# EasyEDA Pro project RCKid.epro, board RCKid
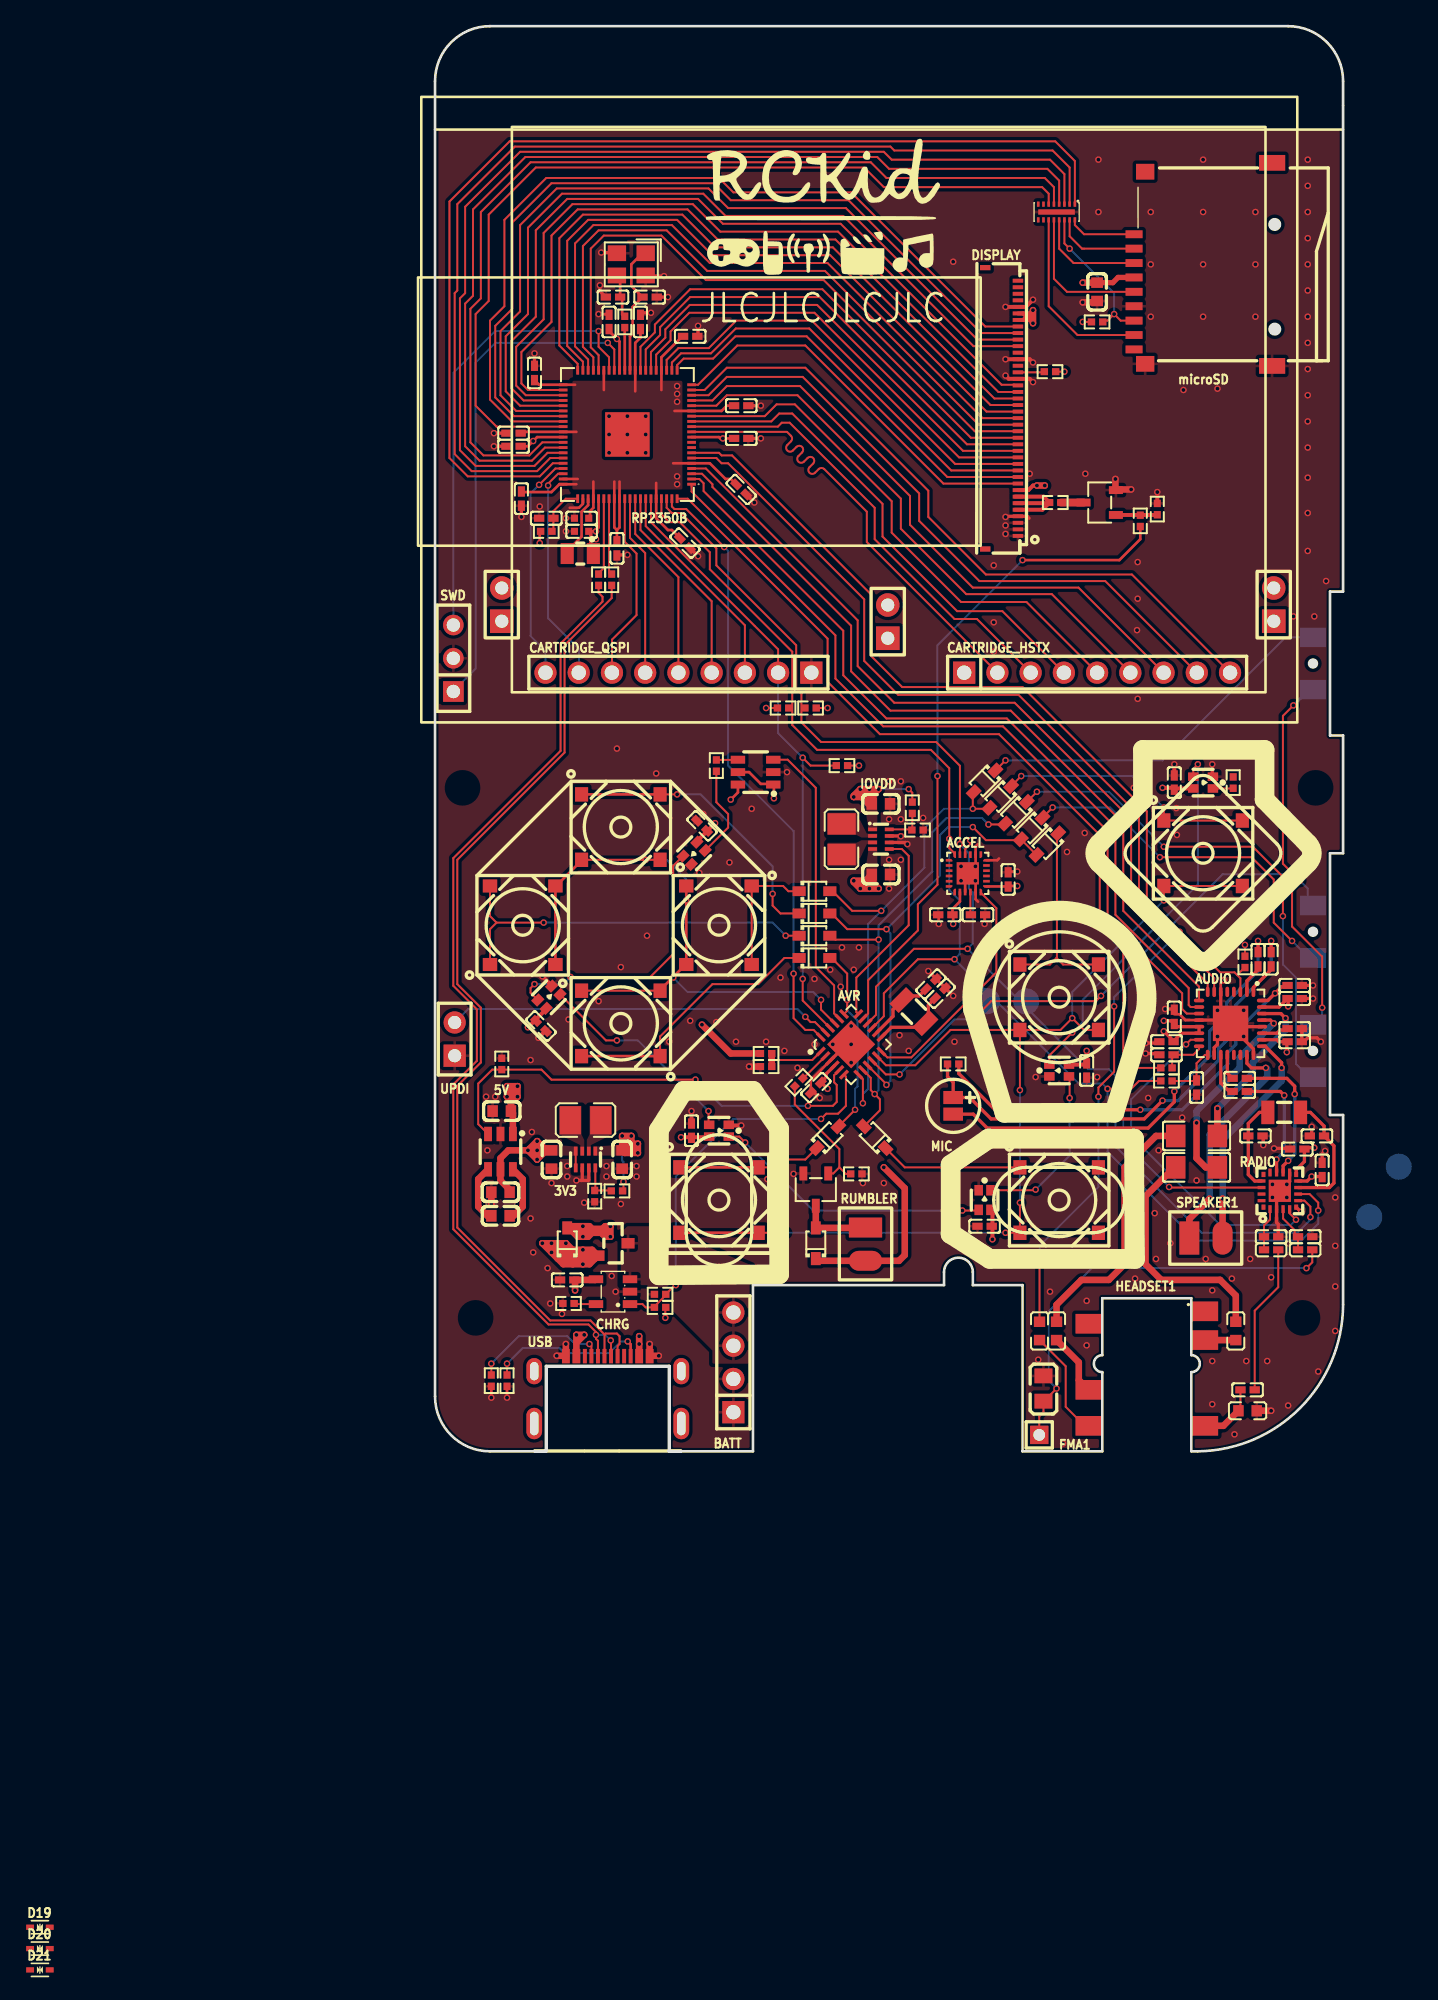
[diagram p27: board, top side]
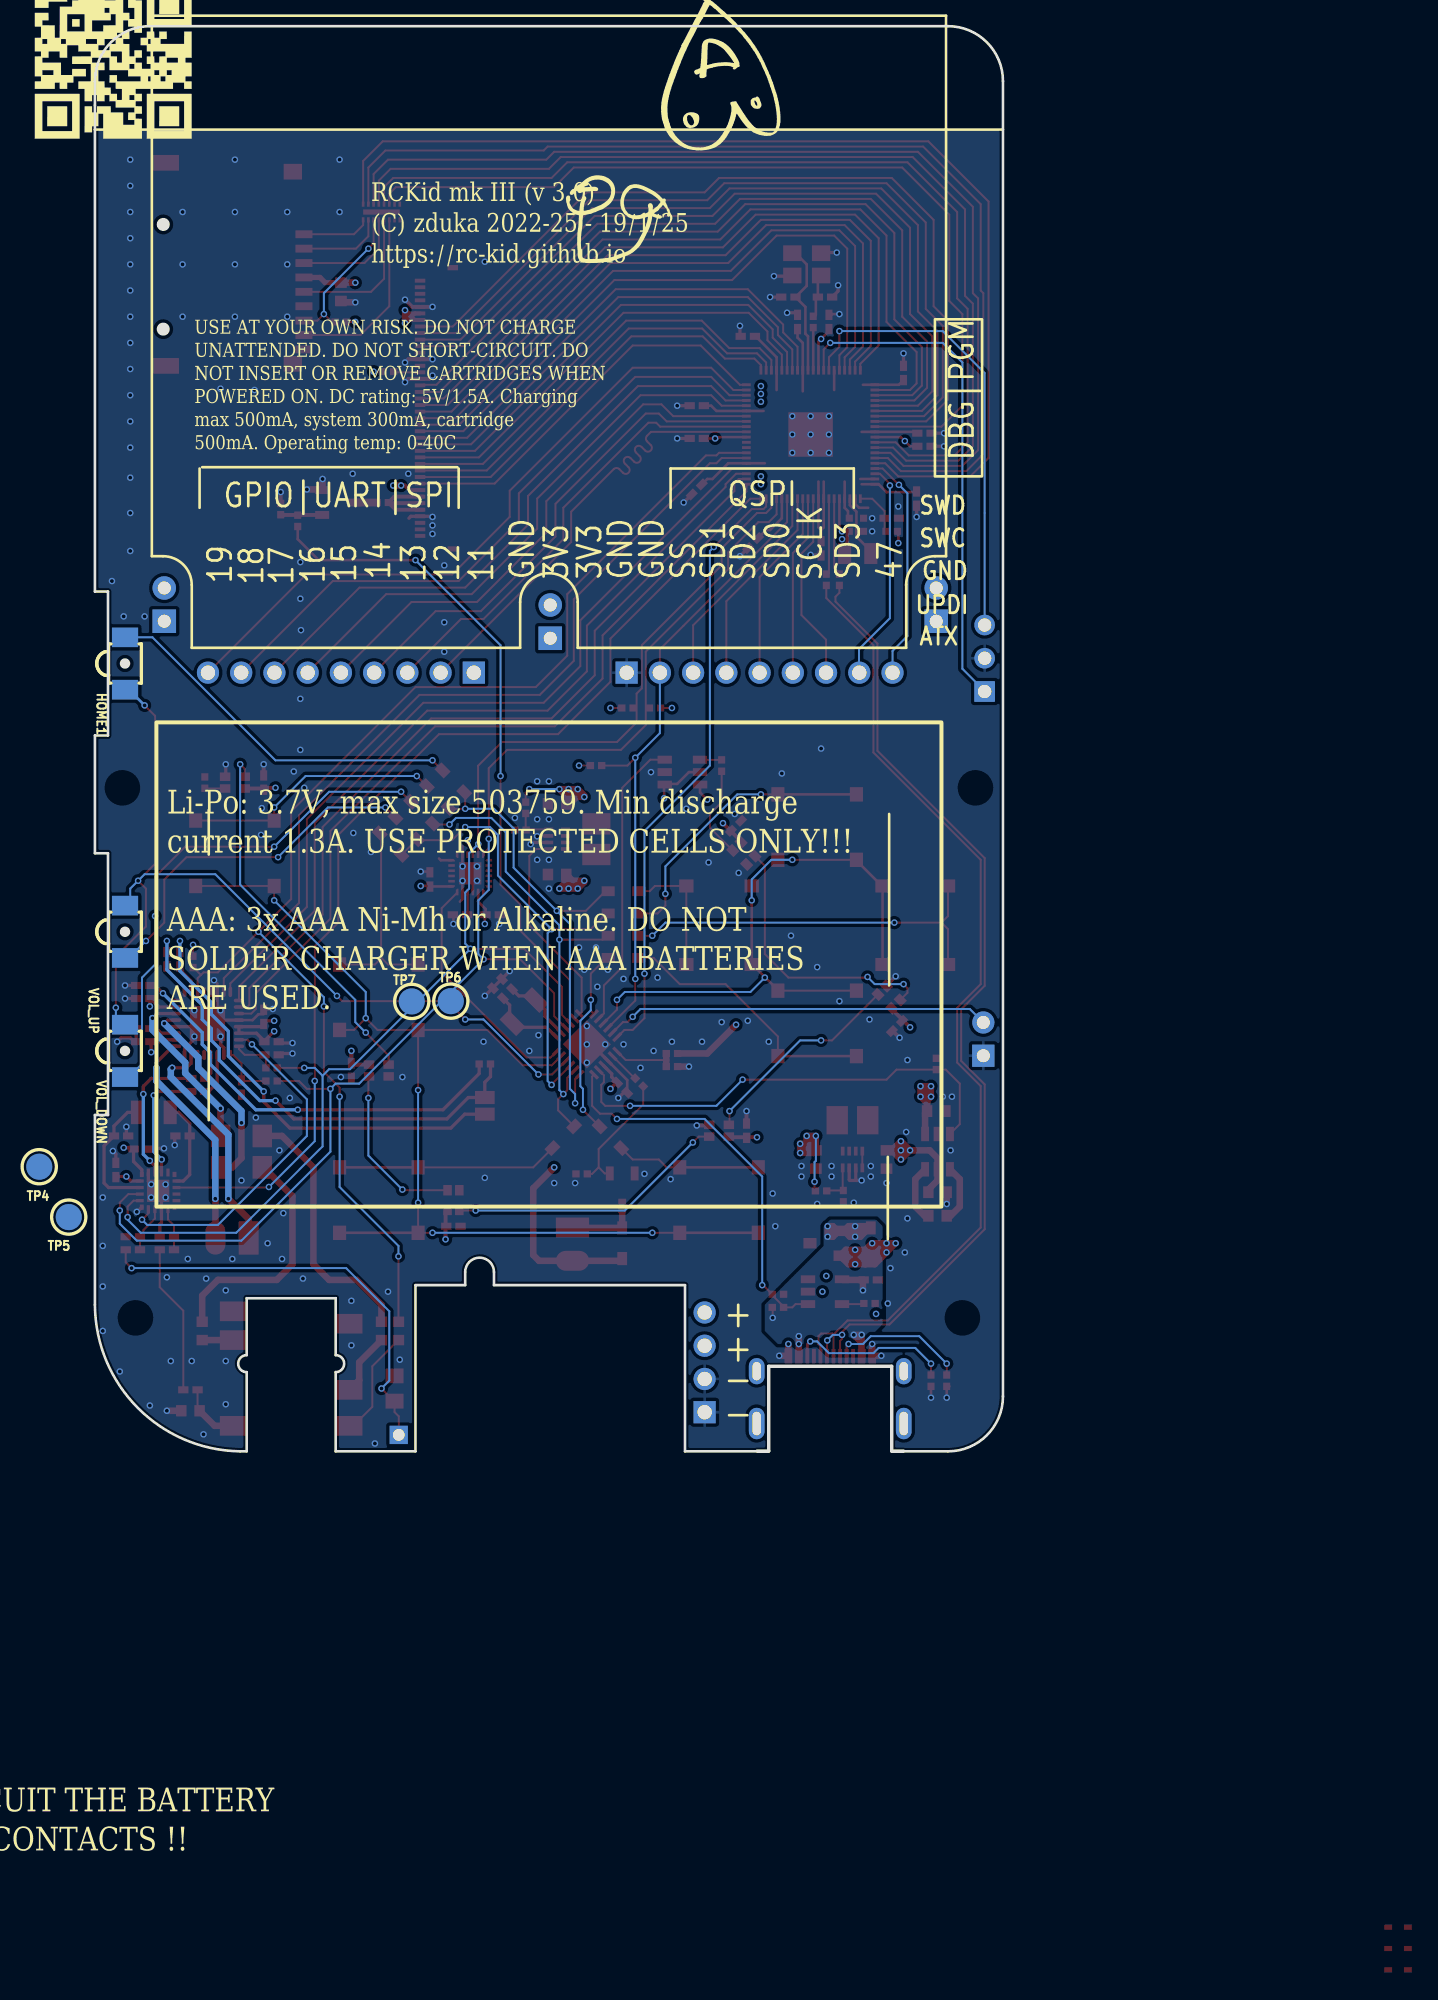
[diagram p28: board, bottom side, seen from below]

Outline 69.4 x 108.9 mm; copper layers: Top Layer, Inner1, Inner2, Bottom Layer. Coordinates in mm from the lower left corner of the outline.
Outline path: 0,104.7 arc(1.23,107.67) 4.2,108.9 65.2,108.9 arc(68.17,107.67) 69.4,104.7 69.4,65.7 68.4,65.7 68.4,54.7 69.4,54.7 69.4,45.7 68.4,45.7 68.4,25.7 69.4,25.7 69.4,11.2 arc(66.14,3.34) 58.3,0 57.8,0 57.8,6.05 arc(58.45,6.7) 57.8,7.35 57.8,11.7 51,11.7 51,7.35 arc(50.35,6.7) 51,6.05 51,0 44.9,0 44.9,12.7 41.1,12.7 41.1,13.7 arc(40,14.8) 38.9,13.7 38.9,12.7 24.3,12.7 24.3,0 17.9,0 17.9,6.5 8.5,6.5 8.5,0 4.2,0 arc(1.23,1.23) 0,4.2 0,104.7
Stack: Top Layer 0.035mm / Dielectric1 0.28mm PP er 4.5 / Inner1 0.035mm / Dielectric2 0.28mm FR4 er 4.5 / Inner2 0.035mm / Dielectric3 0.28mm PP er 4.5 / Bottom Layer 0.035mm

## Design rules (mm)
net USB_DM: DP1
net USB_DP: DP1
template: JLCPCB Capability(Two Layers Board)
spacing copperThickness1oz (default): track to track 0.102, other pairs 0.152 to 0.3
spacing copperThickness2oz: track to track 0.203, other pairs 0.152 to 0.3
track width copperThickness1oz (default): min 0.127, default 0.254, max 2.54
track width copperThickness2oz: min 0.203, default 0.254, max 2.54
differential pair differentialPair (default): width min 0.127, default 0.254, max 2.54; gap min 0.152, default 0.152
via viaSize (default): diameter min 0.5, default 0.61, max 10; hole min 0.3, default 0.305, max 6.3

## Placement (name value [footprint] x y rotation side)
3V3  TPS631000DRLR  [SOT-583-8_L2.1-W1.2-P0.50-LS1.6-BL]  11.5 22.3 180 top
5V  HX4002-MFC  [SOT-23-6_L2.9-W1.6-P0.95-LS2.8-BR]  5 22.9 90 top
A1  SKRRACE010  [KEY-SMD_4P-L7.5-W7.0-P5.00-TL]  47.7 34.7 0 top
ACCEL  MPU-6500  [QFN-24_L3.0-W3.0-P0.40-BL-EP]  40.71 44.17 270 top
AUDIO  NAU88C22YG  [QFN-32_L5.0-W5.0-P0.50-BL-EP2.7]  60.8 32.7 180 top
AVR  ATTINY3217-MFR  [WQFN-24_L4.0-W4.0-P0.50-TL-EP2.6]  31.8 31.1 45 top
B1  SKRRACE010  [KEY-SMD_4P-L7.5-W7.0-P5.00-TL]  58.7 45.7 0 top
B2  SKRRACE010  [KEY-SMD_4P-L7.5-W7.0-P5.00-TL]  47.7 19.2 0 top
B3  SKRRACE010  [KEY-SMD_4P-L7.5-W7.0-P5.00-TL]  21.7 19.2 0 top
BATT  -  [HDR-TH_4P-P2.54-V-M]  22.8 6.8 90 top
BOTTOM1  SKRRACE010  [KEY-SMD_4P-L7.5-W7.0-P5.00-TL]  21.7 40.2 270 top
C81  10uF  [C0603]  5 19.8 0 top
C82  10uF  [C0603]  5.1 26 0 top
C83  2.2uF  [C0603]  5 18 0 top
C101  100nF  [C0402]  49.8 29.1 90 top
C102  100nF  [C0402]  56.5 51.1 270 top
C104  100nF  [C0402]  8.1 32.5 135 top
C107  100nF  [C0402]  23.4 73.5 135 top
C108  100nF  [C0402]  19.1 69.4 135 top
C109  100nF  [C0402]  19.5 85.2 180 top
C110  100nF  [C0402]  6 77.8 0 top
C111  100nF  [C0402]  7.6 82.4 270 top
C112  100nF  [C0402]  23.4 79.9 180 top
C114  100nF  [C0402]  6 76.8 0 top
C115  1uF  [C0402]  23.4 77.4 180 top
C116  1uF  [C0402]  6.6 72.8 90 top
C117  100nF  [C0402]  15.7 86.3 270 top
C118  100nF  [C0402]  29.1 27.8 45 top
C121  1uF  [C0402]  10.1 13.1 0 top
C132  22uF  [C0603]  50.6 88.6 90 top
C143  100nF  [C0402]  19.6 24.5 270 top
C144  100nF  [C0402]  42 17.2 0 top
C153  15pF  [C0402]  16.4 88.2 0 top
C154  15pF  [C0402]  13.6 88.2 180 top
C167  100nF  [C0402]  13.9 69 90 top
C199  220uF  [C1206]  58.2 24.1 0 top
C200  220uF  [C1206]  58.2 21.7 0 top
C209  1uF  [C0402]  61.5 28.5 180 top
C210  4.7uF  [C0402]  13.3 86.3 270 top
C211  4.7uF  [C0402#2]  11.2 71.3 0 top
C212  4.7uF  [C0402#2]  11.2 70.3 0 top
C213  4.7uF  [C0402]  8.5 71.3 180 top
C232  120pF  [C0402]  38.6 35 225 top
C233  120pF  [C0402]  37.9 35.7 225 top
C236  22nF  [C0402]  65.9 23.1 0 top
C237  100nF  [C0402]  67.8 21.5 90 top
C238  120pF  [C0402]  67.4 24.1 180 top
C239  120pF  [C0402]  62.7 24.1 180 top
C242  100pF  [C0402]  62.1 4.7 0 top
C243  33pF  [C0402]  55.9 30.3 180 top
C244  33pF  [C0402]  58.2 27.8 270 top
C245  4.7uF  [C0402]  65.7 34.6 180 top
C246  4.7uF  [C0402]  65.7 31.3 180 top
C247  4.7uF  [C0402]  65.7 32.3 180 top
C248  4.7uF  [C0402]  55.9 31.3 0 top
C249  4.7uF  [C0402]  56.5 33.2 270 top
C250  4.7uF  [C0402]  65.7 35.6 180 top
C251  1uF  [C0402]  61.5 27.5 180 top
C254  1uF  [C0402]  63.9 37.6 90 top
C255  1uF  [C0402]  62.9 37.6 90 top
C256  6pF  [C0402]  63.9 16.4 0 top
C259  22uF  [C0603]  8.9 22.3 90 top
C260  22uF  [C0603]  34.08 44.08 180 top
C261  47uF  [C0603]  14.3 22.3 90 top
C262  47uF  [C0603]  34.08 49.48 180 top
C263  100nF  [C0402]  43.8 43.7 270 top
C264  100nF  [C0402]  41.5 41 180 top
C265  10nF  [C0402]  39 41 0 top
C266  100nF  [C0402]  20.4 47.8 315 top
C267  3.3pF  [C0402]  66.5 16.4 0 top
CARTRIDGE_HSTX  -  [HDR-TH_9P-P2.54-V-M]  50.6 59.5 0 top
CARTRIDGE_QSPI  -  [HDR-TH_9P-P2.54-V-M]  18.6 59.5 180 top
CHRG  MCP73832T-2ACI/OT  [SOT-23-5_L3.0-W1.7-P0.95-LS2.8-BR]  13.6 12.2 0 top
D4  1N5819WS  [SOD-323_L1.8-W1.3-LS2.5-RD]  29.1 15.9 90 top
D5  1N5819WS  [SOD-323_L1.8-W1.3-LS2.5-RD]  29 42.8 0 top
D6  1N5819WS  [SOD-323_L1.8-W1.3-LS2.5-RD]  29 41.1 0 top
D7  1N5819WS  [SOD-323_L1.8-W1.3-LS2.5-RD]  29 39.4 0 top
D8  1N5819WS  [SOD-323_L1.8-W1.3-LS2.5-RD]  29 37.7 0 top
D9  1N5819WS  [SOD-323_L1.8-W1.3-LS2.5-RD]  43.2 50 225 top
D10  1N5819WS  [SOD-323_L1.8-W1.3-LS2.5-RD]  46.8 46.4 225 top
D11  1N5819WS  [SOD-323_L1.8-W1.3-LS2.5-RD]  33.6 24 135 top
D12  1N5819WS  [SOD-323_L1.8-W1.3-LS2.5-RD]  30 24 45 top
D14  1N5819WS  [SOD-323_L1.8-W1.3-LS2.5-RD]  45.6 47.6 225 top
D15  1N5819WS  [SOD-323_L1.8-W1.3-LS2.5-RD]  44.4 48.8 225 top
D17  1N5819WS  [SOD-323_L1.8-W1.3-LS2.5-RD]  42 51.2 225 top
D18  BAT60JFILM  [SOD-323_L1.8-W1.3-LS2.5-RD]  10.1 15.9 90 top
D19  H5VUD5BB  [SOD-523_L1.2-W0.8-LS1.6-BI]  -30.2 -36.37 0 top
D20  H5VUD5BB  [SOD-523_L1.2-W0.8-LS1.6-BI]  -30.2 -38 0 top
D21  H5VUD5BB  [SOD-523_L1.2-W0.8-LS1.6-BI]  -30.2 -39.62 0 top
DISPLAY  X05A10H40G  [FPC-SMD_X05A10H40G]  43.3 79.7 270 top
FMA1  -  [HDR-TH_1P-V-M_XKB_X4611WV-01I-C28D40]  46.18 1.25 0 top
H4  -  [HDR-TH_2P-P2.54-V-M-1]  5.1 64.7 90 top
H5  -  [HDR-TH_2P-P2.54-V-M-1]  64.1 64.7 90 top
H6  -  [HDR-TH_2P-P2.54-V-M-1]  34.6 63.4 90 top
HEADSET1  PJ-342D  [AUDIO-SMD_PJ-342D]  54.4 -0.8 90 top
HOME1  B3U-3000PM-B  [key-smd_b3u-3000pm-b]  67.1 60.2 90 bottom
IOVDD  TPS631000DRLR  [SOT-583-8_L2.1-W1.2-P0.50-LS1.6-BL]  34.08 46.78 270 top
L15  IP4252CZ16-8-TTL,1  [UDFN-16_L3.3-W1.4-P0.40-BL-EP]  47.5 94.7 180 top
L16  AOTA-B201610S3R3-101-T  [IND-SMD_L2.0-W1.6_AOTA-B201610S3R3-101-T]  11.1 68.6 0 top
L18  270nH  [L0603]  62.1 3.1 0 top
L19  120nH  [L0805]  46.5 4.8 90 top
L21  BLM18BD252SN1D  [L0603]  46.2 9.2 90 top
L22  BLM18BD252SN1D  [L0603]  47.5 9.2 90 top
L23  BLM18BD252SN1D  [L0603]  61.2 9.2 90 top
L24  BLM15GA750SN1D  [L0402]  63.9 15.4 0 top
L25  15nH  [L0402]  66.5 15.4 180 top
LED7  XL-1615RGBC-WS2812B  [LED-SMD_4P-L1.6-W1.5_XL-1615RGBC-WS2812B]  47.7 29.1 0 top
LED8  XL-1615RGBC-WS2812B  [LED-SMD_4P-L1.6-W1.5_XL-1615RGBC-WS2812B]  58.7 51.1 180 top
LED10  XL-1615RGBC-WS2812B  [LED-SMD_4P-L1.6-W1.5_XL-1615RGBC-WS2812B]  8.7 34.7 225 top
LED11  XL-1615RGBC-WS2812B  [LED-SMD_4P-L1.6-W1.5_XL-1615RGBC-WS2812B]  21.7 24.5 180 top
LED12  XL-1615RGBC-WS2812B  [LED-SMD_4P-L1.6-W1.5_XL-1615RGBC-WS2812B]  42 19.2 270 top
LED13  XL-1615RGBC-WS2812B  [LED-SMD_4P-L1.6-W1.5_XL-1615RGBC-WS2812B]  19.8 45.7 45 top
LEFT1  SKRRACE010  [KEY-SMD_4P-L7.5-W7.0-P5.00-TL]  14.2 47.7 0 top
MIC  GMI4015-2C-56db  [MIC-SMD_BD4.0_GMI4015-2C-32DB]  39.6 26.4 270 top
microSD  TF-01A  [TF-SMD_TF-01A]  58.7 90.7 90 top
Q6  AO3400A  [SOT-23-3_L2.9-W1.6-P1.90-LS2.8-BR]  50.8 72.5 0 top
Q9  AO3400A  [SOT-23-3_L2.9-W1.6-P1.90-LS2.8-BR]  29.1 20 90 top
Q10  AO3401A  [SOT-23_L2.9-W1.3-P1.90-LS2.4-BR]  13.6 15.9 180 top
R45  2.2kΩ  [R0402]  28.7 56.8 0 top
R46  2.2kΩ  [R0402]  26.6 56.8 180 top
R48  10kΩ  [R0402]  5.1 29.6 90 top
R50  22Ω  [R0402]  12.5 66.6 90 top
R51  22Ω  [R0402]  13.5 66.6 90 top
R54  10kΩ  [R0402]  32.2 21.2 0 top
R55  10kΩ  [R0402]  55.2 72 90 top
R56  10kΩ  [R0402]  31.1 52.4 0 top
R57  5.1kΩ  [R0402]  5.5 5.4 270 top
R58  5.1kΩ  [R0402]  4.3 5.4 270 top
R76  10kΩ  [R0402]  50.6 86.3 0 top
R84  5.11Ω  [R0402]  47.4 72.5 0 top
R86  2.2kΩ  [R0402]  10.2 11.3 0 top
R87  470Ω  [R0402]  21.5 52.4 270 top
R88  470Ω  [R0402]  61 51.1 90 top
R91  1kΩ  [R0402]  27.8 28.2 45 top
R92  1kΩ  [R0402]  53.9 71.1 270 top
R93  1kΩ  [R0402]  14.5 86.3 90 top
R109  33Ω  [R0402]  8.5 70.3 0 top
R128  10kΩ  [R0402]  47 82.5 0 top
R130  220Ω  [R0402]  55.9 28.3 180 top
R131  220Ω  [R0402]  55.9 29.3 180 top
R132  2.2kΩ  [R0402]  39.6 29.6 0 top
R133  511kΩ  [R0402]  13.9 19.9 0 top
R134  511kΩ  [R0402]  36.48 49.18 90 top
R135  91kΩ  [R0402]  12.2 19.5 90 top
R136  91kΩ  [R0402]  36.88 47.48 180 top
R137  100kΩ  [R0402]  17.2 11 0 top
R138  100kΩ  [R0402]  25.3 30.4 180 top
R139  200kΩ  [R0402]  17.2 12 0 top
R140  200kΩ  [R0402]  25.3 29.4 0 top
R141  100kΩ  [R0402]  61.9 37.4 270 top
RADIO  SI4705-D60-GMR  [QFN-20_L3.0-W3.0-P0.50-TL-EP1.7_SILICON-LABS_SI4X55]  64.57 19.91 90 top
RIGHT1  SKRRACE010  [KEY-SMD_4P-L7.5-W7.0-P5.00-TL]  14.2 32.7 180 top
RP2350B  RP2350B  [QFN-80_L10.0-W10.0-P0.40-TL-EP3.4]  14.7 77.7 180 top
RUMBLER  -  [SMT wire pad (2)]  32.9 17.1 0 top
SPEAKER1  -  [SMT wire pad (2)]  57.65 16.3 90 top
SWD  -  [HDR-TH_3P-P2.54-V-F]  1.4 60.6 90 top
TOP1  SKRRACE010  [KEY-SMD_4P-L7.5-W7.0-P5.00-TL]  6.7 40.2 90 top
TP4  -  [TESTPOINT-SMD_BD1.5_P70-5000045R]  73.65 21.75 180 bottom
TP5  -  [TESTPOINT-SMD_BD1.5_P70-5000045R]  71.4 17.9 180 bottom
TP6  -  [TESTPOINT-SMD_BD1.5_P70-5000045R]  42.2 34.4 180 bottom
TP7  -  [TESTPOINT-SMD_BD1.5_P70-5000045R]  45.18 34.38 180 bottom
U33  SN74LVC1T45DBVR  [SOT-23-6_L2.9-W1.6-P0.95-LS2.8-BR]  24.5 51.9 0 top
U39  ABM8-272-T3  [CRYSTAL-SMD_4P-L3.2-W2.5-BL]  15 90.7 180 top
U46  1uH  [L1008]  11.5 25.3 0 top
U47  1uH  [L1008]  31.08 46.78 90 top
UPDI  -  [HDR-TH_2P-P2.54-V-F]  1.5 31.5 90 top
USB  TYPE-C-F02C-1BBWC1.6  [USB-C-SMD_TYPE-C-F02C-1BBWC1.6]  13.2 4.7 0 top
VOL_DOWN  B3U-3000PM-B  [key-smd_b3u-3000pm-b]  67.1 30.6 90 bottom
VOL_UP  B3U-3000PM-B  [key-smd_b3u-3000pm-b]  67.1 39.7 90 bottom
X1  32.768kHz  [FC-135R_L3.2-W1.5]  36.6 33.6 135 top
X2  32.768kHz  [FC-135R_L3.2-W1.5]  64.9 25.9 180 top

## Footprints (pads in the part's own frame, mm; a bottom-side part is the same pattern mirrored in y, then rotated)
AUDIO-SMD_PJ-342D
  rect 1.5x2 smd: 1(2.75,-4.45) 2(2.75,4.45) 3(9.3,-4.45) 4(5.5,4.45) 5(10.55,4.45) 6(11.5,-4.45)
C0402
  rect 0.79x0.54 smd: 1(-0.545,0) 2(0.545,0)
C0402#2
  rect 0.54x0.54 smd: 1(-0.545,0) 2(0.545,0)
C0603
  rect 0.8x0.9 smd: 1(-0.7,0) 2(0.7,0)
C1206
  rect 1.485x1.728 smd: 1(-1.593,0) 2(1.593,0)
CRYSTAL-SMD_4P-L3.2-W2.5-BL
  rect 1.4x1.2 smd: 1(-1.1,-0.85) 2(1.1,-0.85) 3(1.1,0.85) 4(-1.1,0.85)
FC-135R_L3.2-W1.5
  rect 1x1.8 smd: 1(-1.25,0) 2(1.25,0)
FPC-SMD_X05A10H40G
  rect 0.3x0.8 smd: 1(9.75,1.25) 2(9.25,1.25) 3(8.75,1.25) 4(8.25,1.25) 5(7.75,1.25) 6(7.25,1.25) 7(6.75,1.25) 8(6.25,1.25) 9(5.75,1.25) 10(5.25,1.25) 11(4.75,1.25) 12(4.25,1.25) 13(3.75,1.25) 14(3.25,1.25) 15(2.75,1.25) 16(2.25,1.25) 17(1.75,1.25) 18(1.25,1.25) 19(0.75,1.25) 20(0.25,1.25) 21(-0.25,1.25) 22(-0.75,1.25) 23(-1.25,1.25) 24(-1.75,1.25) 25(-2.25,1.25) 26(-2.75,1.25) 27(-3.25,1.25) 28(-3.75,1.25) 29(-4.25,1.25) 30(-4.75,1.25) 31(-5.25,1.25) 32(-5.75,1.25) 33(-6.25,1.25) 34(-6.75,1.25) 35(-7.25,1.25) 36(-7.75,1.25) 37(-8.25,1.25) 38(-8.75,1.25) 39(-9.25,1.25) 40(-9.75,1.25)
  rect 0.4x0.8 smd: 41(-10.75,-1.25) 42(10.75,-1.25)
HDR-TH_1P-V-M_XKB_X4611WV-01I-C28D40
  rect 1.4x1.4 hole 0.9: 1(0,0)
HDR-TH_2P-P2.54-V-F
  rect 1.7x1.7 hole 1: 1(-1.27,0)
  round 1.7 hole 1: 2(1.27,0)
HDR-TH_2P-P2.54-V-M-1
  rect 1.8x1.8 hole 1: 1(-1.27,0)
  round 1.8 hole 1: 2(1.27,0)
HDR-TH_3P-P2.54-V-F
  rect 1.575x1.575 hole 1.02: 1(-2.54,0)
  round 1.575 hole 1.02: 2(0,0) 3(2.54,0)
HDR-TH_4P-P2.54-V-M
  rect 1.7x1.7 hole 1.1: 1(-3.81,0)
  round 1.7 hole 1.1: 2(-1.27,0) 3(1.27,0) 4(3.81,0)
HDR-TH_9P-P2.54-V-M
  rect 1.7x1.7 hole 1.1: 1(-10.16,0)
  round 1.7 hole 1.1: 2(-7.62,0) 3(-5.08,0) 4(-2.54,0) 5(0,0) 6(2.54,0) 7(5.08,0) 8(7.62,0) 9(10.16,0)
IND-SMD_L2.0-W1.6_AOTA-B201610S3R3-101-T
  rect 1x1.6 smd: 1(-1,0) 2(1,0)
KEY-SMD_4P-L7.5-W7.0-P5.00-TL
  rect 1x1.1 smd: 1(-3,2.5) 2(-3,-2.5) 3(3,2.5) 4(3,-2.5)
key-smd_b3u-3000pm-b
  rect 1.5x2 smd: 1(-2,0) 2(2,0)
L0402
  rect 0.79x0.54 smd: 1(-0.545,0) 2(0.545,0)
L0603
  rect 0.8x0.864 smd: 1(-0.7,0) 2(0.7,0)
L0805
  rect 1.133x1.377 smd: 1(-0.966,0) 2(0.966,0)
L1008
  rect 1.635x2.16 smd: 1(-1.167,0) 2(1.167,0)
LED-SMD_4P-L1.6-W1.5_XL-1615RGBC-WS2812B
  rect 0.8x0.65 smd: 1(-0.75,0.45) 2(0.75,0.45) 3(-0.75,-0.45) 4(0.75,-0.45)
MIC-SMD_BD4.0_GMI4015-2C-32DB
  rect 1x1.5 smd: 1(-0.635,0) 2(0.635,0)
QFN-20_L3.0-W3.0-P0.50-TL-EP1.7_SILICON-LABS_SI4X55
  rect 0.4x0.3 smd: 1(-1.25,1.25) 6(-1.25,-1.25) 11(1.25,-1.25) 16(1.25,1.25)
  rect 0.6x0.25 smd: 2(-1.4,0.75) 3(-1.4,0.25) 4(-1.4,-0.25) 5(-1.4,-0.75) 12(1.4,-0.75) 13(1.4,-0.25) 14(1.4,0.25) 15(1.4,0.75)
  rect 0.25x0.6 smd: 7(-0.75,-1.4) 8(-0.25,-1.4) 9(0.25,-1.4) 10(0.75,-1.4) 17(0.75,1.4) 18(0.25,1.4) 19(-0.25,1.4) 20(-0.75,1.4)
  rect 1.7x1.7 smd: 21(0,0)
QFN-24_L3.0-W3.0-P0.40-BL-EP
  custom 0.2x0.506 smd: 1(-1,-1.427) 6(1,-1.427) 13(1,1.427) 18(-1,1.427)
  rect 0.2x0.505 smd: 2(-0.6,-1.427) 3(-0.2,-1.427) 4(0.2,-1.427) 5(0.6,-1.427) 14(0.6,1.427) 15(0.2,1.427) 16(-0.2,1.427) 17(-0.6,1.427)
  custom 0.506x0.2 smd: 7(1.427,-1) 12(1.427,1) 19(-1.427,1) 24(-1.427,-1)
  rect 0.505x0.2 smd: 8(1.427,-0.6) 9(1.427,-0.2) 10(1.427,0.2) 11(1.427,0.6) 20(-1.427,0.6) 21(-1.427,0.2) 22(-1.427,-0.2) 23(-1.427,-0.6)
  rect 1.7x1.7 smd: 25(0,0)
QFN-32_L5.0-W5.0-P0.50-BL-EP2.7
  oval 0.28x0.79 smd: 1(-1.75,-2.408) 2(-1.25,-2.408) 3(-0.75,-2.408) 4(-0.25,-2.408) 5(0.25,-2.408) 6(0.75,-2.408) 7(1.25,-2.408) 8(1.75,-2.408) 17(1.75,2.408) 18(1.25,2.408) 19(0.75,2.408) 20(0.25,2.408) 21(-0.25,2.408) 22(-0.75,2.408) 23(-1.25,2.408) 24(-1.75,2.408)
  oval 0.79x0.28 smd: 9(2.408,-1.75) 10(2.408,-1.25) 11(2.408,-0.75) 12(2.408,-0.25) 13(2.408,0.25) 14(2.408,0.75) 15(2.408,1.25) 16(2.408,1.75) 25(-2.408,1.75) 26(-2.408,1.25) 27(-2.408,0.75) 28(-2.408,0.25) 29(-2.408,-0.25) 30(-2.408,-0.75) 31(-2.408,-1.25) 32(-2.408,-1.75)
  rect 2.7x2.7 smd: 33(0,0)
QFN-80_L10.0-W10.0-P0.40-TL-EP3.4
  rect 0.665x0.22 smd: 1(-4.907,3.8) 2(-4.907,3.4) 3(-4.907,3) 4(-4.907,2.6) 5(-4.907,2.2) 6(-4.907,1.8) 7(-4.907,1.4) 8(-4.907,1) 9(-4.907,0.6) 10(-4.907,0.2) 11(-4.907,-0.2) 12(-4.907,-0.6) 13(-4.907,-1) 14(-4.907,-1.4) 15(-4.907,-1.8) 16(-4.907,-2.2) 17(-4.907,-2.6) 18(-4.907,-3) 19(-4.907,-3.4) 20(-4.907,-3.8) 41(4.907,-3.8) 42(4.907,-3.4) 43(4.907,-3) 44(4.907,-2.6) 45(4.907,-2.2) 46(4.907,-1.8) 47(4.907,-1.4) 48(4.907,-1) 49(4.907,-0.6) 50(4.907,-0.2) 51(4.907,0.2) 52(4.907,0.6) 53(4.907,1) 54(4.907,1.4) 55(4.907,1.8) 56(4.907,2.2) 57(4.907,2.6) 58(4.907,3) 59(4.907,3.4) 60(4.907,3.8)
  rect 0.22x0.665 smd: 21(-3.8,-4.907) 22(-3.4,-4.907) 23(-3,-4.907) 24(-2.6,-4.907) 25(-2.2,-4.907) 26(-1.8,-4.907) 27(-1.4,-4.907) 28(-1,-4.907) 29(-0.6,-4.907) 30(-0.2,-4.907) 31(0.2,-4.907) 32(0.6,-4.907) 33(1,-4.907) 34(1.4,-4.907) 35(1.8,-4.907) 36(2.2,-4.907) 37(2.6,-4.907) 38(3,-4.907) 39(3.4,-4.907) 40(3.8,-4.907) 61(3.8,4.907) 62(3.4,4.907) 63(3,4.907) 64(2.6,4.907) 65(2.2,4.907) 66(1.8,4.907) 67(1.4,4.907) 68(1,4.907) 69(0.6,4.907) 70(0.2,4.907) 71(-0.2,4.907) 72(-0.6,4.907) 73(-1,4.907) 74(-1.4,4.907) 75(-1.8,4.907) 76(-2.2,4.907) 77(-2.6,4.907) 78(-3,4.907) 79(-3.4,4.907) 80(-3.8,4.907)
  rect 3.4x3.4 smd: 81(0,0)
R0402
  rect 0.566x0.54 smd: 1(-0.433,0) 2(0.433,0)
SMT wire pad (2)
  rect 2.54x1.524 smd: 1(0,0)
  rrect 2.54x1.524 smd: 2(0,-2.54)
SOD-323_L1.8-W1.3-LS2.5-RD
  rect 1x0.75 smd: 1(-1.173,0) 2(1.173,0)
SOD-523_L1.2-W0.8-LS1.6-BI
  rect 0.6x0.4 smd: 1(-0.75,0) 2(0.75,0)
SOT-23-3_L2.9-W1.6-P1.90-LS2.8-BR
  rect 1.07x0.6 smd: 1(1.235,-0.95) 2(1.235,0.95) 3(-1.235,0)
SOT-23-5_L3.0-W1.7-P0.95-LS2.8-BR
  rect 1.1x0.6 smd: 1(1.3,-0.95) 2(1.3,0) 3(1.3,0.95) 4(-1.3,0.95) 5(-1.3,-0.95)
SOT-23-6_L2.9-W1.6-P0.95-LS2.8-BR
  rect 1.1x0.6 smd: 1(1.35,-0.95) 2(1.35,0) 3(1.35,0.95) 4(-1.35,0.95) 5(-1.35,0) 6(-1.35,-0.95)
SOT-23_L2.9-W1.3-P1.90-LS2.4-BR
  rect 1x0.8 smd: 1(1.15,-0.95) 2(1.15,0.95) 3(-1.15,0)
SOT-583-8_L2.1-W1.2-P0.50-LS1.6-BL
  rect 0.28x0.68 smd: 1(-0.75,-0.64) 2(-0.25,-0.64) 3(0.25,-0.64) 4(0.75,-0.64) 5(0.75,0.64) 6(0.25,0.64) 7(-0.25,0.64) 8(-0.75,0.64)
TESTPOINT-SMD_BD1.5_P70-5000045R
  round 2 smd: 1(0,0)
TF-SMD_TF-01A
  rect 0.6x1.3 smd: 1(2.3,5.276) 2(1.2,5.276) 3(0.101,5.276) 4(-1,5.276) 5(-2.099,5.276) 6(-3.2,5.276) 7(-4.3,5.276) 8(-5.399,5.276) 9(-6.5,5.276)
  rect 1.2x1.4 smd: 10(-7.599,4.426) 13(7.08,4.426)
  rect 1.2x2 smd: 11(-7.76,-5.276) 12(7.76,-5.276)
UDFN-16_L3.3-W1.4-P0.40-BL-EP
  rect 0.2x0.4 smd: 1(-1.4,-0.6) 2(-1,-0.6) 3(-0.6,-0.6) 4(-0.2,-0.6) 5(0.2,-0.6) 6(0.6,-0.6) 7(1,-0.6) 8(1.4,-0.6) 9(1.4,0.6) 10(1,0.6) 11(0.6,0.6) 12(0.2,0.6) 13(-0.2,0.6) 14(-0.6,0.6) 15(-1,0.6) 16(-1.4,0.6)
  rect 2.8x0.4 smd: 17(0,0)
USB-C-SMD_TYPE-C-F02C-1BBWC1.6
  oval 1.2x2 hole 0.65x1.4: 13(5.62,1.425) 16(-5.62,1.425)
  oval 1.2x2.4 hole 0.65x1.8: 14(5.62,-2.575) 15(-5.62,-2.575)
  rect 0.3x1.1 smd: A5(-1.25,2.575) A6(-0.25,2.575) A7(0.25,2.575) A8(1.25,2.575) B5(1.75,2.575) B6(0.75,2.575) B7(-0.75,2.575) B8(-1.75,2.575)
  rect 0.6x1.1 smd: A9B4(2.4,2.575) A12B1(3.2,2.575) B9A4(-2.4,2.575) B12A1(-3.2,2.575)
WQFN-24_L4.0-W4.0-P0.50-TL-EP2.6
  rect 0.85x0.25 smd: 1(-2.025,1.25) 2(-2.025,0.75) 3(-2.025,0.25) 4(-2.025,-0.25) 5(-2.025,-0.75) 6(-2.025,-1.25) 13(2.025,-1.25) 14(2.025,-0.75) 15(2.025,-0.25) 16(2.025,0.25) 17(2.025,0.75) 18(2.025,1.25)
  rect 0.25x0.85 smd: 7(-1.25,-2.025) 8(-0.75,-2.025) 9(-0.25,-2.025) 10(0.25,-2.025) 11(0.75,-2.025) 12(1.25,-2.025) 19(1.25,2.025) 20(0.75,2.025) 21(0.25,2.025) 22(-0.25,2.025) 23(-0.75,2.025) 24(-1.25,2.025)
  rect 2.6x2.6 smd: 25(0.001,0)

## Nets
As in the schematic.

Pads without a net: ACCEL 1 2 3 4 5 6 7 14 15 16 17 19 21; AUDIO 4 5 21 22; D19 1 2; D20 1 2; D21 1 2; DISPLAY 27 37 38 39 40 41 42; H4 1 2; H5 1 2; H6 1 2; HEADSET1 5 6; L15 7 8 9 10; microSD 9 12 13; R88 2; RADIO 1 15 16 20; RP2350B 8; USB 13 14 15 16 A8 B8

## Via types
v1: diameter 0.5, hole 0.3, Top Layer to Bottom Layer, 427 vias

## Routing (per net, layer and track width the routed paths; a pad name or vN(x,y) marks a point on that pad's centre or on a via; arc(x,y) is an arc through that point)
3V3: length 42.9
  Top Layer w0.15: v1(40.9,46.7) 40.9,46.4 40.52,46.01 ACCEL.22 ; v1(14.4,20.6) 14.4,19.97 R133.2
  Top Layer w0.2: ACCEL.13 43.79,43.17 C263.2 43.85,43.2 v1(44.5,43.2) 44.47,43.17 ; ACCEL.8 40.11,42.01 39.55,41.44 C265.2 39.6,40.94 v1(39.6,40.3) ; U33.5 24,51.9 24.9,51 25.8,51 U33.1 25.9,50.9 v1(25.9,49.9)
  Top Layer w0.25: v1(30,27.7) 29.51,28.19 C118.2 29.9,28.6 29.9,28.85 AVR.4
  Top Layer w0.3: DISPLAY.8 45.35,73.45 45.7,73.8 v1(46,73.8)
  Top Layer w0.5: v1(15.5,23.5) 14.8,23.5 ; v1(15.5,23.5) v1(15.5,22.8) ; v1(15.5,23.5) 15.15,23.15 ; 14.8,23.5 C261.2 ; 14.8,23.5 15,23.7 v1(15,24.1) v1(14.3,24.1) 14.3,24 ; 14.8,23.5 15.15,23.15 ; 14.8,23.5 14.3,24 ; v1(34.3,21.7) 35.9,20.1 35.9,15 35.46,14.56 RUMBLER.2 29.27,14.56 D4.1 ; v1(46,73.8) v1(46.6,73.8) ; v1(15.5,22.8) 14.5,22.8 C261.2 ; v1(15.5,22.8) 15.15,23.15 ; C261.2 14.3,24 ; C261.2 15,23 15.15,23.15
  Bottom Layer w0.15: v1(14.3,24.1) 14.3,22.2 14.4,22.1 v1(14.4,20.6)
5V: length 22.8
  Top Layer w0.2: v1(22.6,49.8) 23.15,50.35 U33.6
  Top Layer w0.3: v1(21.4,48) 20.01,46.61 LED13.2 ; v1(7.1,32.4) 8.49,33.79 LED10.2 ; v1(49.8,30.6) C101.2 49.7,29.55 LED7.2 ; v1(55.6,50.7) 56.36,50.7 C102.2 56.6,50.65 LED8.2 ; LED12.2 42.6,18.3 v1(42.6,16.2) ; LED11.2 20.9,24 v1(18.8,24)
  Top Layer w0.5: v1(5.5,27.1) v1(6.3,27.1) ; v1(5.5,27.1) v1(5.5,27.9) v1(6.3,27.9) ; v1(5.5,27.1) v1(6.3,27.9) ; v1(5.5,27.1) 5.8,26.8 5.8,26.6 ; v1(6.3,27.1) 5.8,26.6 ; v1(6.3,27.1) v1(6.3,27.9) ; 5.8,26.6 C82.2 5.95,25.85 5V.1
5V_ON: length 36.1
  Top Layer w0.15: AVR.5 30.5,28.74 30.5,28.2 30.7,28 30.7,26.7 30.4,26.4 v1(28.5,26.4) ; v1(19.9,28.4) 8.9,28.4 8.13,29.17 R48.1 ; R48.1 5.03,29.1 ; R48.1 4.37,29.17 3.3,28.1 3.3,25 5V.3
  Bottom Layer w0.15: v1(19.9,28.4) 21.9,26.4 v1(28.5,26.4)
DVDD: length 15
  Top Layer w0.2: 11.9,70.3 12.2,70.3 12.5,70.6 RP2350B.65 ; C114.2 7.1,76.8 v1(7.5,77.2) 7.8,77.5 RP2350B.51 ; RP2350B.32 14.1,84.8 v1(13.9,85) 13.3,85.6 13.3,85.75 ; RP2350B.10 21.7,77.5 21.8,77.4 v1(22,77.4) C115.2
  Top Layer w0.25: 11.9,70.3 11.9,68.9 12.2,68.6
  vias: v1(12.3,70.3) v1(12.3,69.7)
GND: length 95.6
  Top Layer w0.2: v1(44.5,44.3) 43.86,44.3 C263.1 ; C264.1 42,40.95 v1(42,40.3) ; AVR.3 28.71,28.37 C118.1 ; 4.1,4.97 4.3,4.77 v1(4.3,4.1) ; 13.1,86.84 13.05,86.9 v1(12.5,86.9) ; v1(41.3,43.6) 41.32,43.58 41.32,42.18 41.5,42 ; v1(60.3,36) 60.05,35.75 AUDIO.6 ; 10.3,72.1 11,72.1 11.3,72.4 RP2350B.62 ; v1(38.5,40.3) 38.5,40.95 C265.1 ; ACCEL.18 42.97,45.17 43.1,45.3 ; v1(41.3,44.7) 41.32,44.71 41.32,46.21 41.5,46.4 ; v1(5.5,4.1) R57.2 ; AUDIO.12 57.35,32.95 56.9,33.4 56.5,33.4 ; ACCEL.9 40.52,44.38 v1(40.2,44.7)
  Top Layer w0.25: v1(67.1,35.6) C250.1 ; 11.2,20.7 11.25,20.75 3V3.6 ; 11.2,20.7 v1(10.8,20.7) ; 11.2,20.7 11.7,20.7 11.75,20.75 3V3.7 ; C118.1 28.99,27.41 v1(29.4,27) ; v1(36.1,46.4) 35.97,46.53 IOVDD.6 ; v1(20.1,68.4) C108.1 ; U39.2 13.85,91.6 v1(12.7,91.6) ; 64.57,19.91 64.32,19.66 RADIO.3 64.32,17.48 64.45,17.35 C256.2 ; v1(17.8,88.2) C153.2 ; C154.2 12.6,88.65 v1(12.6,89.1) ; v1(59.8,31.7) 59.8,31.1 59.55,30.85 AUDIO.18 ; v1(67,24.8) 67,24.24 C238.2 ; 15.7,86.94 15.76,87 v1(16.5,87) ; AUDIO.12 60.55,32.95 ; 60.55,32.95 60.05,33.45 AUDIO.6 ; 60.55,32.95 AUDIO.33 61.05,32.45 AUDIO.28 ; v1(67.1,34.6) C245.1 ; C243.2 55.26,30.4 v1(54.3,30.4) ; C247.1 C246.1 66.4,31.3 66.7,31.59 67.41,31.59 v1(67.7,31.3) ; v1(24.9,79.9) C112.1 ; C109.1 20.1,85.25 v1(20.1,86) ; v1(61.8,31.7) 61.8,31.5 62.55,30.75 AUDIO.24 ; v1(68.02,22.95) 67.8,22.72 C237.2 ; v1(54.3,31.2) 55.26,31.2 C248.1 ; v1(59.4,52.5) 59.4,51.6 LED8.3 ; v1(37.7,36.7) v1(39.6,34.8) ; v1(7.6,83.9) C111.1 ; v1(43.6,71.4) 43.65,71.45 DISPLAY.4 45.25,71.45 45.4,71.3 ; v1(64.12,23.15) 65.31,23.15 C236.1 ; v1(31.8,31.1) 31.45,31.1 AVR.3 ; v1(17.5,89.8) 16.15,89.8 U39.4 ; v1(66.2,18.3) 66.17,18.3 RADIO.6 ; C239.1 63.3,24.04 v1(63.3,23.4) ; v1(65.1,20.4) 65.32,20.62 65.32,21.31 ; v1(4.5,77.8) C110.1 ; IOVDD.7 35.57,47.03 v1(35.6,47) ; v1(24.9,77.4) C115.1 ; C167.1 13.95,68.5 v1(14.7,68.5) ; C107.1 24.24,72.66 24.24,72.61 24.35,72.5 v1(24.4,72.5) ; v1(4.5,76.8) C114.1 ; v1(55.8,33.8) 56.45,33.8 C249.1 ; v1(6.6,71.4) 6.6,72.25
  Top Layer w0.3: v1(55.2,73.3) R55.2 ; v1(45.7,81.7) 45.45,81.95 DISPLAY.25 43.85,81.95 v1(43.6,82.2) ; C104.1 8.41,32.11 v1(7.9,31.6) ; v1(45.7,88) 45.15,87.45 DISPLAY.36 ; v1(23.4,24.9) 22.5,24.9 LED11.3 ; 44.45,87.45 v1(43.6,87.45) ; LED10.3 8.91,35.59 v1(8.2,36.3) ; 56.5,51.64 v1(56.5,52.5) ; v1(19.6,26) C143.1 ; v1(45.7,83.2) 45.45,83.45 DISPLAY.28 v1(43.6,83.45)
  Top Layer w0.5: v1(17.1,7.3) 16.42,7.3 USB.A12B1 v1(16.4,8.2) ; R140.1 v1(24,29.4) ; v1(63.9,3.1) L18.2 ; v1(49.5,87.8) 50.5,87.8 C132.1 ; v1(52,74.3) 52,73.48 Q6.2 52.08,73.5 v1(53.2,73.5) ; v1(10,8.2) USB.B12A1 9.98,7.3 v1(9.3,7.3) ; C81.1 v1(4.3,18.9)
  Bottom Layer w0.15: SWD.2 1.6,60.6
  vias: v1(3.9,27.1) v1(4,23) v1(4.6,27.1) v1(7.3,29.9) v1(7.3,17.8) v1(7.4,24.4) v1(7.5,15.2) v1(8,72.2) v1(8.6,14) v1(8.8,11.3) v1(8.9,20.5) v1(9.7,10.5) v1(10,71.3) v1(10,70.3) v1(10.1,21.8) v1(10.1,21) v1(10.2,33) v1(11.4,19) v1(12.5,34.4) v1(13.1,21.8) v1(13.1,21) v1(13.3,79.1) v1(13.3,77.7) v1(13.3,76.3) v1(13.5,13.4) v1(13.8,12.2) v1(13.9,53.7) v1(14.2,37) v1(14.2,18.9) v1(14.7,79.1) v1(14.7,77.7) v1(14.7,76.3) v1(15.4,21.8) v1(15.4,21) v1(16.1,79.1) v1(16.1,77.7) v1(16.1,76.3) v1(16.2,39.4) v1(16.9,51.8) v1(17.4,17.2) v1(17.6,19.7) v1(17.9,31.3) v1(19.5,32.9) v1(20.2,44.2) v1(20.5,48.7) v1(21.5,32.8) v1(22.5,45) v1(23,31.3) v1(24.2,49.1) v1(25.3,31.3) v1(25.4,20.8) v1(26.4,36.2) v1(26.7,30.6) v1(26.9,51.9) v1(27.4,21.2) v1(27.7,29.3) v1(29,36.1) v1(29,31.1) v1(30.2,36.8) v1(30.4,31.1) v1(31,35.5) v1(31.1,38.5) v1(31.8,32.5) v1(31.8,29.7) v1(32,36.8) v1(32.4,38.5) v1(32.7,20.5) v1(34.3,20.5) v1(34.7,51.2) v1(34.7,48.3) v1(34.7,45.2) v1(34.7,43) v1(35.5,31.8) v1(35.6,51.2) v1(35.6,48.3) v1(35.6,45.2) v1(36.2,30.6) v1(37.3,48.4) v1(39.6,90.9) v1(39.6,20.9) v1(39.7,31.3) v1(40.2,43.6) v1(42.7,67.7) v1(42.7,63.35) v1(42.7,61.1) v1(43.6,70.75) v1(43.6,70.1) v1(45.45,74.7) v1(45.9,28.6) v1(46.1,7) v1(47,12.2) v1(48,0.6) v1(48.3,45.8) v1(49.65,47.25) v1(49.7,74.7) v1(49.8,11.5) v1(49.8,8.1) v1(50.6,28.6) v1(50.7,98.7) v1(50.7,94.7) v1(53.4,50.7) v1(53.5,13.2) v1(53.65,62.75) v1(53.7,67.95) v1(53.7,65.15) v1(53.7,57.5) v1(53.7,53.6) v1(54.2,51.95) v1(54.5,27) v1(54.7,94.7) v1(54.7,90.7) v1(54.7,86.7) v1(55,18.2) v1(55.1,14.7) v1(55.3,23) v1(56.2,15.9) v1(56.65,49.15) v1(56.7,47.1) v1(57.1,25.5) v1(57.2,81.1) v1(58.2,20.7) v1(58.7,98.7) v1(58.7,94.7) v1(58.7,90.7) v1(58.7,86.7) v1(58.9,14.7) v1(59.4,12.3) v1(59.4,6.9) v1(59.4,3.6) v1(59.8,81.2) v1(59.8,33.7) v1(60.9,13.2) v1(61.1,1.3) v1(61.8,33.7) v1(62,6.9) v1(62.3,14.7) v1(62.7,94.7) v1(62.7,90.7) v1(62.7,86.7) v1(63.6,6.9) v1(63.9,13.3) v1(64,20.4) v1(64,19.4) v1(65.1,19.4) v1(65.2,3.5) v1(65.6,63.8) v1(66.7,98.7) v1(66.7,96.7) v1(66.7,94.7) v1(66.7,92.7) v1(66.7,90.7) v1(66.7,88.7) v1(66.7,86.7) v1(66.7,84.7) v1(66.7,82.7) v1(66.7,80.7) v1(66.7,78.7) v1(66.7,76.7) v1(66.7,74.4) v1(66.7,71.7) v1(66.7,68.8) v1(67.2,63.8) v1(67.5,6.1) v1(68.1,66.5) v1(68.8,19.4) v1(68.8,15.7) v1(68.8,12.6) v1(68.8,9.2)
VCC: length 45.6
  Top Layer w0.15: 3V3.5 3V3.4
  Top Layer w0.5: 8.5,23 C259.2 ; 8.5,23 v1(7.8,23) ; 8.5,23 v1(7.8,23.7) ; 8.5,23 v1(7.8,22.3) ; 12.23,14.73 11.8,14.3 v1(11.3,14.3) 10.53,14.3 ; 12.23,14.73 D18.1 ; 12.23,14.73 Q10.2 ; v1(7.8,22.3) v1(7.8,23) ; v1(7.8,22.3) v1(7.1,23) ; v1(7.8,23) 7.2,23 ; v1(7.8,23) v1(7.8,23.7) ; v1(33.2,43) v1(32.5,43) ; v1(33.2,43) 33.2,43.7 ; v1(33.2,43) v1(33.9,43) 33.5,43.4 33.5,43.95 C260.2 ; v1(32.5,43) 33.2,43.7 ; v1(32.5,43) 32,43.5 v1(32,43.6) 32.9,43.6 33.2,43.9 ; 10.3,15.3 10.65,14.95 Q10.2 ; v1(20.4,32.6) 22.6,30.4 R138.2 ; 33.2,43.9 C260.2 ; 33.2,43.9 33.2,43.7 ; C260.2 33.38,43.88 33.2,43.7 ; 9.37,14.73 9.8,14.3 10.53,14.3 ; 9.37,14.73 v1(8.9,15.2) v1(8.2,15.9) v1(8.9,15.9) ; 9.37,14.73 D18.1 ; D18.1 10,14.83 v1(10,15.9) ; D18.1 10.53,14.3 ; 7.2,23 5.6,23 5,22.4 5V.5 5,20.7 5.7,20 C81.2 ; 7.2,23 7.2,23.1 v1(7.8,23.7) ; v1(8.9,15.9) 8.9,15.7 9.6,15 9.6,15.5 9.7,15.6 9.4,15.6 9.2,15.8 ; v1(8.9,15.9) v1(10,15.9) ; Q10.2 12,15.4 v1(11.3,15.4) 10.5,15.4 v1(10,15.9)
VCC_SENSE: length 5.1
  Top Layer w0.15: AVR.1 28.83,29.9 25.7,29.9
  Top Layer w0.5: R140.2 R138.1
ACCEL_INT: length 18.3
  Top Layer w0.15: AVR.12 34.57,30.1 36.4,30.1 42.9,36.6 42.9,41.5 41.71,42.68 ACCEL.12
AVR_INT: length 46.8
  Top Layer w0.15: AVR.24 28.93,32.2 28.3,32.2 27.4,33.1 v1(27.4,36.5) ; v1(22.1,69.1) 19.2,72 18.3,72 18.1,72.2 RP2350B.79
  Bottom Layer w0.15: v1(22.1,69.1) 22.4,68.8 22.4,52.4 27.4,47.4 v1(27.4,36.5)
BTN_1: length 36.7
  Top Layer w0.15: 42.37,49.17 42.3,49.1 v1(41.1,49.1) 41.1,50.3 41.17,50.37 ; v1(34.1,41.3) 31.88,41.3 30.38,42.8 D5.2 ; AVR.7 32.7,28.43 v1(32.7,26.6)
  Bottom Layer w0.15: v1(41.1,49.1) 38.9,49.1 37.4,47.6 37.4,44.6 v1(34.1,41.3) 33.1,40.3 33.1,27.7 32.7,27.3 v1(32.7,26.6)
BTN_2: length 36.5
  Top Layer w0.15: D6.2 30.3,41.1 31.5,39.9 v1(34.5,39.9) ; v1(41.1,47.7) 42.1,46.7 44.7,46.7 44.77,46.77 45.97,45.57 ; v1(34.5,28) 34.5,28.05 AVR.9
  Bottom Layer w0.15: v1(41.1,47.7) 39.2,47.7 38.6,47.1 38.6,44 v1(34.5,39.9) 34.8,39.6 34.8,28.3 v1(34.5,28)
BTN_3: length 37.4
  Top Layer w0.15: 32.7,24.9 32.77,24.83 34,26.06 34,26.9 v1(33.6,27.3) 33.3,27.6 33.3,28.54 AVR.8 ; D7.2 30.3,39.4 30.6,39.1 v1(33.9,39.1) ; v1(42.3,47.9) 43.5,47.9 43.57,47.97
  Bottom Layer w0.15: v1(42.3,47.9) 41.8,48.4 39.1,48.4 38,47.3 38,44.3 33.9,40.2 v1(33.9,39.1) 33.9,27.6 v1(33.6,27.3)
BTN_4: length 15.6
  Top Layer w0.15: D8.2 30.3,37.7 31.5,36.5 v1(31.5,34.5) 31.5,33.66 AVR.19 ; 30.83,24.83 v1(32.1,26.1)
  Bottom Layer w0.15: v1(32.1,26.1) 32.1,27.7 32.3,27.9 32.3,32.9 31.5,33.7 v1(31.5,34.5)
BTN_ABXY: length 85.7
  Top Layer w0.15: v1(55.7,42.1) B1.2 B1.4 ; v1(44.7,27.6) A1.2 ; A1.2 47.8,32.2 v1(48.7,33.1) 49.6,32.2 A1.4 ; A1.2 39.4,32.2 36.7,29.5 34.46,29.5 AVR.11 ; v1(26.8,16.7) B3.4 ; B2.2 44.6,16.8 ; B2.2 v1(44.7,19) ; B2.2 v1(43.6,16.7)
  Top Layer w0.2: B2.4 B2.2 ; B3.4 B3.2
  Bottom Layer w0.15: v1(44.7,19) v1(44.7,27.6) ; v1(55.7,42.1) 48.7,35.1 v1(48.7,33.1) ; v1(43.6,16.7) v1(26.8,16.7)
BTN_CTRL: length 70.2
  Top Layer w0.15: v1(65.6,57) 64.8,56.2 64.8,44.9 v1(66.1,43.6) 65.5,43 65.5,40.1 67.8,37.8 v1(67.8,33.9) ; v1(41.1,33) 42.5,34.4 50.5,34.4 v1(50.9,34.8) ; AVR.10 34.45,28.8 v1(35.5,28.8)
  Bottom Layer w0.15: v1(67.8,33.9) 67.8,33.3 VOL_DOWN.2 ; v1(50.9,34.8) 60.2,44.1 65.6,44.1 v1(66.1,43.6) 66.7,43 66.7,41.9 66.5,41.7 ; v1(35.5,28.8) 39.7,33 v1(41.1,33)
  Bottom Layer w0.2: v1(65.6,57) 66.5,57.9 66.5,58.2
BTN_DPAD: length 49.4
  Top Layer w0.15: LEFT1.2 v1(16.1,45.2) LEFT1.4 ; v1(29.5,34.5) 29.5,33.75 AVR.21 ; RIGHT1.4 RIGHT1.2
  Top Layer w0.2: RIGHT1.2 17.2,35.25 19.15,37.2 BOTTOM1.4 v1(19.2,42.1) BOTTOM1.2 ; 11.2,35.25 RIGHT1.4 ; 9.25,37.2 TOP1.2 TOP1.4 9.25,43.2 11.2,45.15 LEFT1.2
  Bottom Layer w0.15: v1(19.2,42.1) 19.2,43.7 17.7,45.2 v1(16.1,45.2) ; v1(29.5,34.5) 28.9,35.1 19.3,35.1 v1(18.2,36.2)
CHARGING: length 30.4
  Top Layer w0.15: AVR.6 31.4,28.64 31.4,26.4 30.8,25.8 29.9,25.8 v1(29.5,25.4) ; CHRG.1 15.85,11.25 16.1,11 R137.1 16.77,11.07 17.63,11.93 R139.2 18.33,12.7 v1(18.4,12.7)
  Bottom Layer w0.15: v1(29.5,25.4) 22.8,25.4 18.4,21 v1(18.4,12.7)
DB_0: length 60.7
  Top Layer w0.15: 44.33,81.45 44.27,81.5 43.3,81.5 31,93.8 22,93.8 20.1,95.7 10.1,95.7 7.7,93.3 7.7,86.7 5.8,84.8 5.8,81.27 6.77,80.3 RP2350B.44
DB_1: length 59.3
  Top Layer w0.15: 44.33,80.95 43.05,80.95 30.8,93.2 21.8,93.2 19.7,95.3 10.5,95.3 8.3,93.1 8.3,86.5 6.2,84.4 6.2,81.43 6.93,80.7 RP2350B.43
DB_2: length 57.9
  Top Layer w0.15: RP2350B.42 7.1,81.1 6.6,81.6 6.6,84 8.9,86.3 8.9,92.9 10.9,94.9 19.3,94.9 21.6,92.6 30.6,92.6 42.75,80.45 44.33,80.45
DB_3: length 52.3
  Top Layer w0.15: RP2350B.40 10.9,83.1 9.5,84.5 9.5,92.7 11.3,94.5 18.9,94.5 21.4,92 30.4,92 42.45,79.95 44.33,79.95
DB_4: length 51.3
  Top Layer w0.15: 44.33,79.45 42.15,79.45 30.2,91.4 21.2,91.4 18.5,94.1 11.7,94.1 10.1,92.5 10.1,84.47 11.3,83.27 RP2350B.39
DB_5: length 50.4
  Top Layer w0.15: 44.33,78.95 41.85,78.95 30,90.8 21,90.8 18.1,93.7 12.1,93.7 10.7,92.3 10.7,84.43 11.7,83.43 RP2350B.38
DB_6: length 49.5
  Top Layer w0.15: 44.33,78.45 41.55,78.45 29.8,90.2 20.8,90.2 17.7,93.3 12.5,93.3 11.3,92.1 11.3,84.4 12.1,83.6 RP2350B.37
DB_7: length 48.6
  Top Layer w0.15: 44.33,77.95 41.25,77.95 29.7,89.5 20.7,89.5 17.3,92.9 12.9,92.9 11.9,91.9 11.9,84.36 12.5,83.76 RP2350B.36
DB_8: length 37.3
  Top Layer w0.15: 44.33,77.45 40.95,77.45 29.6,88.8 19.5,88.8 16.8,86.1 16.8,85.5 15.7,84.4 RP2350B.28
DB_9: length 36.5
  Top Layer w0.15: 44.33,76.95 40.65,76.95 29.4,88.2 19.5,88.2 17.2,85.9 17.2,85.3 16.1,84.2 RP2350B.27
DB_10: length 35.7
  Top Layer w0.15: RP2350B.26 16.5,84 17.6,85.1 17.6,85.73 19.47,87.6 29.2,87.6 40.35,76.45 44.33,76.45
DB_11: length 34.9
  Top Layer w0.15: 44.33,75.95 40.05,75.95 29,87 19.43,87 18,85.57 18,84.9 16.9,83.8 RP2350B.25
DB_12: length 33.2
  Top Layer w0.15: 44.33,75.45 39.75,75.45 28.8,86.4 23.02,86.4 20.92,84.3 18.6,84.3 17.7,83.4 RP2350B.23
DB_13: length 32.4
  Top Layer w0.15: RP2350B.22 18.1,83.2 18.8,83.9 21.09,83.9 22.99,85.8 28.6,85.8 39.45,74.95 44.33,74.95
DB_14: length 31.6
  Top Layer w0.15: RP2350B.21 18.5,83 19,83.5 21.25,83.5 22.95,85.2 28.4,85.2 39.15,74.45 44.33,74.45
DB_15: length 30.3
  Top Layer w0.15: RP2350B.20 20.1,81.5 23.1,84.5 28.3,84.5 38.85,73.95 44.33,73.95
DISP_CSX: length 64.3
  Top Layer w0.15: RP2350B.47 6.03,79.1 4.6,80.53 4.6,86 5.9,87.3 5.9,93.9 8.9,96.9 21.3,96.9 22.6,95.6 31.6,95.6 41.75,85.45 DISPLAY.32
DISP_DCX: length 62.9
  Top Layer w0.15: RP2350B.46 6.2,79.5 5,80.7 5,85.6 6.5,87.1 6.5,93.7 9.3,96.5 20.9,96.5 22.4,95 31.4,95 41.45,84.95 DISPLAY.31
DISP_LED_K: length 8.3
  Top Layer w0.3: 44.33,72.95 46.52,72.95 R84.1 46.92,72.45 ; 44.33,72.45 46.92,72.45 ; 46.92,72.45 46.42,71.95 44.33,71.95
DISP_TE: length 65.7
  Top Layer w0.15: DISPLAY.33 42.05,85.95 31.8,96.2 22.8,96.2 21.7,97.3 8.5,97.3 5.3,94.1 5.3,87.5 4.2,86.4 4.2,80.37 5.87,78.7 RP2350B.48
DISP_WRX: length 61.4
  Top Layer w0.15: DISPLAY.30 41.15,84.45 31.2,94.4 22.2,94.4 20.5,96.1 9.7,96.1 7.1,93.5 7.1,86.9 5.4,85.2 5.4,81 6.5,79.9 RP2350B.45
EMBEDDED_ANTENNA: length 32.9
  Top Layer w0.15: FMA1.1 46.18,2.68 46.5,3 L19.1 46.53,3.83 v1(47.5,4.8) ; L25.1 67.05,14.44 v1(66.6,14)
  Bottom Layer w0.15: v1(47.5,4.8) 46.9,5.4 46.9,10.7 50.2,14 v1(66.6,14)
GPIO_12: length 36.7
  Top Layer w0.15: CARTRIDGE_HSTX.2 33,69.48 33,71.8 29.75,75.05 arc(29.53,75.14) 29.32,75.05 29.05,74.78 arc(28.62,74.78) 28.62,75.2 28.9,75.48 arc(28.9,75.9) 28.47,75.9 28.2,75.63 arc(27.77,75.63) 27.77,76.05 28.05,76.33 arc(28.05,76.75) 27.62,76.75 27.35,76.48 arc(26.92,76.48) 26.92,76.9 27.2,77.18 arc(27.29,77.39) 27.2,77.6 26.9,77.9 RP2350B.11
GPIO_13: length 35.4
  Top Layer w0.15: RP2350B.12 26.2,78.3 26.5,78.6 27.1,78.6 33.6,72.1 33.6,69.7 39.7,63.6 41.42,63.6 CARTRIDGE_HSTX.3
GPIO_14: length 38.4
  Top Layer w0.15: CARTRIDGE_HSTX.4 43.36,64.2 39.9,64.2 34.2,69.9 34.2,72.4 27.3,79.3 26.3,79.3 25.7,78.7 RP2350B.13
GPIO_15: length 41.3
  Top Layer w0.15: CARTRIDGE_HSTX.5 45.2,64.9 40.2,64.9 34.9,70.2 34.9,72.6 27.5,80 26.1,80 25.2,79.1 RP2350B.14
GPIO_16: length 44
  Top Layer w0.15: CARTRIDGE_HSTX.6 47.14,65.5 40.6,65.5 35.6,70.5 35.6,72.8 27.7,80.7 22.3,80.7 21.5,79.9 RP2350B.16
GPIO_17: length 46.9
  Top Layer w0.15: CARTRIDGE_HSTX.7 49.18,66 41.1,66 36.3,70.8 36.3,73 27.9,81.4 22.3,81.4 21.2,80.3 RP2350B.17
GPIO_18: length 49.8
  Top Layer w0.15: RP2350B.18 20.9,80.7 22.3,82.1 28.1,82.1 37,73.2 37,71.1 41.6,66.5 51.22,66.5 CARTRIDGE_HSTX.8
GPIO_19: length 52.7
  Top Layer w0.15: CARTRIDGE_HSTX.9 53.26,67 42.1,67 37.7,71.4 37.7,73.4 28.3,82.8 22.3,82.8 20.6,81.1 RP2350B.19
GPIO_46: length 17.5
  Top Layer w0.15: v1(7.95,73.85) 9.2,75.1 RP2350B.57
  Bottom Layer w0.15: v1(7.95,73.85) 7.3,73.2 7.3,62.3 8.44,61.16 CARTRIDGE_QSPI.9
GPIO_47: length 16.9
  Top Layer w0.15: RP2350B.58 9.4,74.7 8.64,73.94 v1(8.64,73.8)
  Bottom Layer w0.15: v1(8.64,73.8) 8.64,63.66 11,61.3 11,59.52 CARTRIDGE_QSPI.8
HEADSET_ANTENNA: length 11.4
  Top Layer w0.15: L24.2 64.45,12.54 62.64,10.74 C242.2
HEADSET_DETECT: length 101.4
  Top Layer w0.15: 61.3,36.4 61.1,36.6 60,36.6 v1(56.9,39.7) 54.4,42.2 54.4,48.9 44.9,58.4 35.7,58.4 33.3,60.8 33.3,65.5 22.7,76.1 21.9,76.1 21.7,76.3 RP2350B.7 ; 61.3,36.4 61.55,36.15 AUDIO.3 61.49,35.11 ; 61.3,36.4 61.87,36.97 R141.2 ; L21.2 v1(46.2,14.9) ; v1(50.7,27.1) 50.7,27.8 51.9,29 v1(51.9,34)
  Bottom Layer w0.15: v1(56.9,39.7) 51.9,34.7 v1(51.9,34) ; v1(50.7,27.1) 50.7,20.2 46.2,15.7 v1(46.2,14.9)
HEADSET_LEFT: length 13.1
  Top Layer w0.25: v1(65,33.1) 64.65,33.45 AUDIO.30
  Top Layer w0.5: C199.2 59.79,26.19 v1(59.8,26.2)
  Bottom Layer w0.5: v1(65,33.1) 65,32.2 62.5,29.7 62.5,28.9 v1(59.8,26.2)
HEADSET_RIGHT: length 15.6
  Top Layer w0.25: v1(64.1,32.7) 63.85,32.95 AUDIO.29
  Top Layer w0.5: C200.2 58.9,21.7 58.2,22.4 v1(58.2,25.1)
  Bottom Layer w0.5: v1(58.2,25.1) 58.2,26 61.5,29.3 61.5,30.1 v1(64.1,32.7)
I2C_SCL: length 106.5
  Top Layer w0.15: v1(53.4,29.3) R131.2 ; RADIO.7 66.44,19.16 66.9,18.7 v1(66.9,17.9) ; ACCEL.23 40.11,52.38 38.3,54.2 29.5,54.2 28,55.7 28,57.9 27.6,58.3 27.6,61.6 21.5,67.7 21.5,69 18.8,71.7 18.1,71.7 17.7,72.1 RP2350B.78 ; v1(40.7,38.4) 36.6,38.4 33.7,35.5 33.7,33.35 AVR.16
  Bottom Layer w0.15: v1(66.9,17.9) 66.9,17.7 65.9,16.7 58.6,16.7 52,23.3 52,28.7 ; 52,28.7 52.6,29.3 v1(53.4,29.3) ; 52,28.7 51.5,29.2 49.9,29.2 v1(40.7,38.4) 41.1,38.8 41.1,42.7 40.8,43 40.8,45.7 v1(40.1,46.4)
I2C_SDA: length 109
  Top Layer w0.15: R130.2 53.8,28.3 53.2,27.7 v1(51.4,27.7) ; ACCEL.24 39.71,45.68 39.3,46.1 v1(39.3,46.8) 39.3,52.2 37.9,53.6 29.2,53.6 27.3,55.5 27.3,61.1 21,67.4 21,68.7 18.7,71 17.9,71 17.3,71.6 RP2350B.77 ; RADIO.8 66.84,19.66 67.5,19 v1(67.5,18.4) ; AVR.15 34.3,33.25 34.3,35 36.9,37.6 v1(39.7,37.6)
  Bottom Layer w0.15: v1(39.3,46.8) 39.3,42.9 40.1,42.1 40.1,38 v1(39.7,37.6) 49.2,28.1 51,28.1 v1(51.4,27.7) 51.4,22.9 58.2,16.1 66.2,16.1 67.5,17.4 v1(67.5,18.4)
I2S_BCLK: length 62.4
  Top Layer w0.15: RP2350B.4 20.7,75.1 32.3,63.5 32.3,60 35.1,57.2 44.3,57.2 53.2,48.3 53.2,41.6 59.05,35.75 AUDIO.8
I2S_DIN: length 62.5
  Top Layer w0.15: RP2350B.2 20.2,74.3 20.52,73.97 20.52,73.37 31.2,62.7 31.2,59.3 34.5,56 43.7,56 52,47.7 52,41 57.6,35.4 57.6,34.1 57.75,33.95 AUDIO.10
I2S_DOUT: length 62.2
  Top Layer w0.15: AUDIO.9 58.39,35.51 52.6,41.3 52.6,48 44,56.6 34.8,56.6 31.8,59.6 31.8,63.09 21.2,73.69 21.2,73.9 20.4,74.7 RP2350B.3
I2S_LRCLK: length 64.1
  Top Layer w0.15: AUDIO.7 59.55,36.15 53.8,41.9 53.8,48.6 44.6,57.8 35.4,57.8 32.8,60.4 32.8,65.1 22.4,75.5 21.9,75.5 21.5,75.9 RP2350B.6
I2S_MCLK: length 62.4
  Top Layer w0.15: AUDIO.11 57.45,33.45 57.1,33.8 57.1,35 51.4,40.7 51.4,47.4 43.4,55.4 34.25,55.4 30.6,59.05 30.6,62.35 19.61,73.34 RP2350B.1
IOVDD: length 94.4
  Top Layer w0.15: v1(36.2,50.6) 36.48,50.32 R134.2 ; R56.2 v1(32.4,52.4) ; R45.2 v1(30,56.8) ; v1(25.3,56.8) R46.2 ; 61.9,37.83 v1(61.9,38.7) ; R76.1 v1(49.5,86.3) ; R128.2 v1(48.1,82.5)
  Top Layer w0.2: 11.85,71.3 11.85,71.84 12.1,72.1 RP2350B.64 12.1,74.1 ; C110.2 6.64,77.9 RP2350B.50 10.8,77.9 ; 16.9,74 RP2350B.76 16.9,71.3 17.8,70.4 18.1,70.4 C108.2 ; RP2350B.35 12.9,81.1 ; 18.3,79.5 RP2350B.15 21.9,79.5 22.3,79.9 C112.2 ; 18.2,75.5 RP2350B.5 21,75.5 22.2,74.3 22.6,74.3 22.91,73.99 ; 10.7,81.5 RP2350B.41 7.95,81.5 C111.2 ; v1(8,69.4) 8,70.23 8.07,70.3 ; 13.9,70.4 C167.2 ; 13.9,70.4 13.7,70.6 RP2350B.68 13.7,74.1 ; 13.9,70.4 14.1,70.6 RP2350B.69 14.1,74.1 ; C116.2 6.64,73.3 8.9,73.3 9.5,73.9 RP2350B.60 10.8,73.9 ; RP2350B.59 10.9,74.3 ; 18.86,85.2 18.86,85.15 17.3,83.6 RP2350B.24 17.3,81.1 ; 15.7,85.85 15.7,85.1 15.3,84.7 RP2350B.29 15.3,81
  Top Layer w0.25: C248.2 56.45,31.35 v1(55.7,32.1) ; AUDIO.26 64.35,31.45 64.5,31.3 C246.2 65.1,31.24 v1(65.1,30.5) ; v1(55.7,32.9) 56.26,32.9 C249.2 56.7,32.45 AUDIO.13 AUDIO.14 57.05,31.95 56.6,31.5 ; RADIO.11 65.82,21.52 66.45,22.14 C236.2 66.55,23.2 v1(67.2,23.2) ; RADIO.10 66.66,20.66 v1(67,21) 67.76,21 C237.1 ; v1(65.2,34) 65.2,34.55 C245.2 64.51,33.95 AUDIO.31
  Top Layer w0.3: DISPLAY.34 44.95,86.45 ; 44.95,86.45 45.2,86.7 ; 44.95,86.45 45.45,86.45 ; 45.45,86.95 v1(45.7,87.2) ; 45.45,86.95 45.2,86.7 ; 45.45,86.95 44.95,86.95 ; 45.2,86.7 44.95,86.95 ; 45.2,86.7 45.6,86.7 ; 45.2,86.7 45.45,86.45 ; 44.95,86.95 DISPLAY.35 ; 45.45,86.45 v1(45.7,86.2)
  Top Layer w0.4: microSD.4 52.2,89.7 51.8,89.3 C132.2
  Top Layer w0.5: v1(33.2,50.6) v1(33.9,50.6) 33.5,50.2 33.5,49.6 C262.2 ; v1(33.2,50.6) v1(32.5,50.6) ; v1(33.2,50.6) 33.2,49.9 ; v1(32.5,50.6) 32,50.1 v1(32,50) 32.6,50 33.12,49.48 C262.2 ; v1(32.5,50.6) 33.2,49.9 ; v1(45.7,86.2) v1(45.7,87.2) ; 33.2,49.9 33.2,49.65 C262.2 ; 33.2,49.9 33.38,49.72 C262.2 ; C132.2 v1(49.5,89.3)
  Bottom Layer w0.15: v1(36.2,50.6) v1(33.9,50.6)
  vias: v1(18.5,81.4) v1(18.5,80.8) v1(18.5,80.2) v1(18.5,74.5) v1(18.5,73.9)
IOVDD_EN: length 15.5
  Top Layer w0.15: IOVDD.5 35.67,46.03 36.2,45.5 36.2,40.2 32.2,36.2 32.2,33.56 AVR.18
PWM_BACKLIGHT: length 50.7
  Top Layer w0.15: AVR.17 33.1,33.46 33.1,36 36.9,39.8 36.9,41.8 38.4,43.3 v1(38.4,51.6)
  Top Layer w0.2: v1(44.9,68.1) 52.3,68.1 53.9,69.7 R92.2
  Bottom Layer w0.15: v1(38.4,51.6) 38.4,61.6 v1(44.9,68.1)
PWM_RUMBLER: length 2.4
  Top Layer w0.15: AVR.2 28.15,28.51 R91.2
QSPI_SCLK: length 13.8
  Top Layer w0.15: RP2350B.71 14.9,69.8 16.06,68.64 CARTRIDGE_QSPI.6
QSPI_SD0: length 14.7
  Top Layer w0.15: CARTRIDGE_QSPI.5 18.6,66.8 15.3,70.1 RP2350B.72
QSPI_SD1: length 16.4
  Top Layer w0.15: RP2350B.74 16.1,70.7 23.68,63.12 CARTRIDGE_QSPI.3
QSPI_SD2: length 15.5
  Top Layer w0.15: CARTRIDGE_QSPI.4 21.14,64.96 15.7,70.4 RP2350B.73
QSPI_SD3: length 14.4
  Top Layer w0.15: CARTRIDGE_QSPI.7 13.52,62.02 15.4,63.9 15.4,68.6 14.5,69.5 RP2350B.70
QSPI_SS: length 48.9
  Top Layer w0.15: R56.1 28.7,52.4 v1(28.1,53) ; AVR.22 28.1,34.45 v1(28.1,36.1) ; CARTRIDGE_QSPI.2 26.22,61.28 16.5,71 RP2350B.75
  Bottom Layer w0.15: v1(28.1,36.1) v1(28.1,53) 26.22,54.88 CARTRIDGE_QSPI.2
RADIO_INT: length 81.1
  Top Layer w0.15: v1(52.6,28.3) 52.6,38.6 50.8,40.4 50.8,47.1 43.1,54.8 34,54.8 30,58.8 30,62.1 19.31,72.79 RP2350B.80 ; v1(56.1,20.2) 56.14,20.16 RADIO.18
  Bottom Layer w0.15: v1(56.1,20.2) 52.6,23.7 v1(52.6,28.3)
RADIO_L: length 9.1
  Top Layer w0.25: v1(64.9,27.2) 64.6,27.5 C251.1 ; 64.32,21.31 64.32,22.28 v1(64.3,22.3)
  Bottom Layer w0.25: v1(64.3,22.3) 64.9,22.9 v1(64.9,27.2)
RADIO_R: length 10.9
  Top Layer w0.25: v1(65.7,27.3) 65.7,27.9 65.1,28.5 C209.1 ; v1(65.2,22.2) 64.82,21.82 64.82,21.31
  Bottom Layer w0.25: v1(65.2,22.2) 65.7,22.7 v1(65.7,27.3)
RADIO_RESET: length 26.5
  Top Layer w0.15: v1(65.8,17.7) 65.3,18.2 65.3,18.49 RADIO.5 ; AUDIO.15 57.75,31.45 v1(57.4,31.1)
  Bottom Layer w0.15: v1(57.4,31.1) 53.2,26.9 53.2,24.1 60,17.3 65.4,17.3 v1(65.8,17.7)
RGB: length 22.5
  Top Layer w0.15: AVR.20 30.5,33.46 30.5,35.6 29.1,37 29.1,50.7 26.95,52.85 U33.3
RPI_SWCLK: length 38.1
  Top Layer w0.15: v1(13.2,84.7) 13.7,84.2 RP2350B.33
  Bottom Layer w0.15: v1(13.2,84.7) 4.6,84.7 3.1,83.2 3.1,59.8 1.9,58.6
RPI_SWD: length 35
  Top Layer w0.15: v1(12.5,85.6) 12.5,84.4 13.3,83.6 RP2350B.34
  Bottom Layer w0.15: SWD.3 1.4,82.4 4.6,85.6 v1(12.5,85.6)
SD_CSN: length 80.5
  Top Layer w0.15: RP2350B.55 8.8,75.9 7.8,74.9 2.8,74.9 1.5,76.2 1.5,88.5 1.7,88.7 1.7,95.3 6.1,99.7 34.8,99.7 35.1,99.4 47.2,99.4 48.5,98.1 L15.2
SD_RX: length 78.1
  Top Layer w0.15: L15.3 48.1,97.6 47,98.7 34.9,98.7 34.3,99.3 6.5,99.3 2.3,95.1 2.3,88.5 1.9,88.1 1.9,76.5 3.1,75.3 7.6,75.3 8.6,76.3 RP2350B.54
SD_SCK: length 73.3
  Top Layer w0.15: RP2350B.52 8.2,77.1 7.2,76.1 3.7,76.1 2.7,77.1 2.7,87.3 3.5,88.1 3.5,94.7 7.3,98.5 33.3,98.5 34.5,97.3 46.6,97.3 47.3,96.6 L15.5
SD_TX: length 75.7
  Top Layer w0.15: L15.4 47.7,97.1 46.8,98 34.7,98 33.8,98.9 6.9,98.9 2.9,94.9 2.9,88.3 2.3,87.7 2.3,76.8 3.4,75.7 7.4,75.7 8.4,76.7 RP2350B.53
SDIO_1: length 68.3
  Top Layer w0.15: RP2350B.49 4.7,78.3 3.1,79.9 3.1,86.9 4.1,87.9 4.1,94.5 7.7,98.1 32.8,98.1 34.3,96.6 46.4,96.6 46.9,96.1 L15.6
SDIO_2: length 82.9
  Top Layer w0.15: L15.1 48.9,98.6 47.4,100.1 5.7,100.1 1.1,95.5 1.1,75.9 2.5,74.5 8,74.5 9,75.5 RP2350B.56
SPEAKER_LEFT: length 17.3
  Top Layer w0.25: AUDIO.25 63.45,30.95 64.7,29.7 v1(64.7,29.3)
  Top Layer w0.5: SPEAKER1.2 60.19,19.29 v1(60.2,19.3)
  Bottom Layer w0.5: v1(60.2,19.3) 60.2,23.8 64.7,28.3 v1(64.7,29.3)
SPEAKER_RIGHT: length 17.7
  Top Layer w0.25: AUDIO.23 62.05,29.65 62.4,29.3 v1(63.5,29.3)
  Top Layer w0.5: v1(59.2,19.3) 57.65,17.75 SPEAKER1.1
  Bottom Layer w0.5: v1(63.5,29.3) 63.6,29.2 63.6,28.6 59.2,24.2 v1(59.2,19.3)
UPDI: length 29.5
  Top Layer w0.15: AVR.23 29.04,32.8 28.7,32.8 v1(28.3,33.2)
  Bottom Layer w0.15: UPDI.2 2.53,33.8 27.7,33.8 v1(28.3,33.2)
USB_DM: length 74.1
  Top Layer w0.15: v1(13.43,8.48) 13.43,8.27 13.45,8.25 USB.A7
  Top Layer w0.154: USB.B7 12.45,8.45 12.3,8.6 v1(12.3,8.9) 12.3,9.12 11.72,9.69 8.67,9.69 1.39,16.97 1.39,28.04 3.19,29.84 3.19,33.77 1.39,35.57 1.39,45.33 9.59,53.53 9.59,61.73 12.8,64.93 12.8,65.3 12.5,65.6 R50.1
  Bottom Layer w0.15: v1(12.3,8.9) 13.01,8.9 v1(13.43,8.48)
USB_DP: length 74.5
  Top Layer w0.154: 12.95,8.93 11.88,10 8.8,10 1.7,17.1 1.7,27.91 3.5,29.71 3.5,33.9 1.7,35.7 1.7,45.2 9.9,53.4 9.9,61.6 13.5,65.2 13.5,65.97 ; 12.95,8.93 13.02,9 13.9,9 14.1,8.8 14.1,8.2 13.95,8.05 USB.B6 ; 12.95,8.93 USB.A6 12.9,7.32
VREG_AVDD: length 3.8
  Top Layer w0.15: RP2350B.61 9.99,72.79 9.05,71.84 C213.1 9.05,70.41 R109.2
VREG_LX: length 4.8
  Top Layer w0.2: 10.2,68.6 10.2,68.9 11.2,69.9 11.2,71.8 11.7,72.3 RP2350B.63
VUSB: length 20.6
  Top Layer w0.15: v1(17.6,10.2) 17.6,10.97 R137.2
  Top Layer w0.5: v1(13.4,17.2) 13,17.2 12.77,16.97 12.77,16.85 ; v1(13.4,17.2) 13.05,16.85 12.95,16.85 ; v1(13.4,17.2) v1(13.4,16.4) ; 12.77,16.85 Q10.1 11.75,16.85 ; 12.77,16.85 12.77,16.63 13,16.4 v1(13.4,16.4) ; 12.77,16.85 12.95,16.85 ; v1(11.3,16.4) v1(11.3,17.2) ; v1(11.3,16.4) 10.63,17.07 ; v1(11.3,16.4) 11.75,16.85 ; v1(11.3,16.4) 11.7,16.4 11.9,16.6 ; v1(11.3,16.4) 10.9,16.4 10.6,16.7 ; v1(11.3,17.2) 11.17,17.07 10.63,17.07 ; v1(11.3,17.2) 11.65,16.85 11.75,16.85 ; v1(11.3,17.2) 10.23,17.2 D18.2 10.63,17.07 ; v1(11.3,17.2) 11.8,17.2 11.9,17.1 ; 12.95,16.85 v1(13.4,16.4) ; USB.A9B4 v1(15.6,8.2) v1(15.6,8.8) ; 10.8,8.3 v1(11.4,8.9) v1(10.8,8.9) USB.B9A4 ; CHRG.4 12.25,13.1 C121.2 10.7,13.04 v1(10.7,12.3)
XIN: length 10.3
  Top Layer w0.2: U39.1 15.85,91.55 15,90.7 15,89.05 C153.1 15.1,87.44 15.1,85.4 14.9,85.2 RP2350B.30
XOUT: length 3.4
  Top Layer w0.2: RP2350B.31 14.5,85.97
$1N1000: length 4.5
  Top Layer w0.5: C83.1 4,18 3.3,18.7 3.3,20.8 5V.4
$1N1001: length 4.5
  Top Layer w0.5: C83.2 6,18 6.7,18.7 6.7,20.8 5V.6
$1N84601: length 1.7
  Top Layer w0.15: CHRG.5 10.68,11.25 R86.2
$1N105961: length 3
  Top Layer w0.15: R133.1 13.43,19.93 R135.2 12.25,19.98 3V3.8
$1N106225: length 3
  Top Layer w0.15: IOVDD.8 36.39,47.53 R136.2 36.48,47.51 36.48,48.74
$2N19576: length 11.7
  Top Layer w0.15: microSD.7 52.4,86.4 v1(51.9,86.9) 51.4,86.4 51.03,86.4 R76.2 ; L15.14 48.1,92.3 v1(48.5,91.9)
  Bottom Layer w0.15: v1(48.5,91.9) 51.9,88.5 v1(51.9,86.9)
$2N25545: length 5.2
  Top Layer w0.15: microSD.1 49.6,93 48.9,93.7 L15.16
$2N25554: length 6.6
  Top Layer w0.15: microSD.2 49.6,91.9 49.45,91.9 48.5,92.85 L15.15
$2N25581: length 8.4
  Top Layer w0.15: microSD.3 48.8,90.8 47.7,91.9 L15.13
$2N25588: length 11
  Top Layer w0.15: microSD.5 48.3,88.6 47.3,89.6 L15.12
$2N25598: length 14
  Top Layer w0.15: L15.11 46.9,87.5 49.1,85.3 microSD.8
$2N43437: length 1.8
  Top Layer w0.15: C264.2 40.92,41.04 40.92,42.74
$3N73781: length 7
  Top Layer w0.25: RADIO.17 62.64,20.66 62.16,21.14 C239.2 62.16,25.05 63,25.9 X2.2
$3N91282: length 2
  Top Layer w0.25: AUDIO.20 60.55,28.91 C209.2
$3N91283: length 3.3
  Top Layer w0.25: AUDIO.19 60.05,28.15 60.7,27.5 C251.2
$3N91285: length 2.1
  Top Layer w0.25: AUDIO.27 64.35,31.95 64.6,32.2 65.05,32.2 C247.2
$3N91286: length 33.2
  Top Layer w0.25: R132.2 40.03,28.87 42.8,26.1 v1(53.9,26.1) ; AUDIO.32 63.65,34.45 v1(64.2,35) 64.7,35.5 65.05,35.5 C250.2
  Bottom Layer w0.25: v1(53.9,26.1) 57.1,26.1 60.6,29.6 60.6,30.5 61.2,31.1 61.2,32 v1(64.2,35)
$3N91292: length 37.2
  Top Layer w0.25: v1(55.6,26.8) 54.2,25.4 42.5,25.4 40.86,27.03 39.6,27.03 39.6,28.2 39.17,28.63 R132.1 ; v1(63.9,39) 63.9,38.1
  Bottom Layer w0.25: v1(63.9,39) 63.9,36.8 61.2,34.1 61.2,33 60.5,32.3 60.5,31.4 59.9,30.8 59.9,29.9 56.8,26.8 v1(55.6,26.8)
$3N91301: length 34
  Top Layer w0.25: v1(56.5,27.5) 56.5,26.7 54.5,24.7 42.2,24.7 41.14,25.76 MIC.2 ; 62.9,38.14 v1(62.9,39)
  Bottom Layer w0.25: v1(62.9,39) 62.9,36.7 60.5,34.3 60.5,33.4 59.2,32.1 59.2,30.2 v1(56.5,27.5)
$3N93413: length 4.3
  Top Layer w0.15: R130.1 58.16,28.3 C244.1 58.2,29.65 58.84,30.29 AUDIO.17
$3N93472: length 3.4
  Top Layer w0.15: AUDIO.16 58.39,30.74 57.95,30.3 C243.1 56.33,30.19 R131.1
$3N94514: length 2.5
  Top Layer w0.25: AUDIO.1 62.55,35.45 63.9,36.8 C254.1
$3N94519: length 2.3
  Top Layer w0.25: C255.1 62.9,36.8 62.05,35.95 AUDIO.2
$3N94853: length 9.8
  Top Layer w0.25: X2.1 66.9,25.9 67.95,24.85 C238.1 68.7,23.34 68.7,20.5 68.36,20.16 RADIO.9
$3N94920: length 3.3
  Top Layer w0.15: L24.1 C256.1 63.36,17.25 63.82,17.72 RADIO.2
$3N116814: length 3.6
  Top Layer w0.15: L25.2 C267.1 65.7,16.66 65.7,16.9 64.82,17.78 RADIO.4
$4N10766: length 20.6
  Top Layer w0.15: RIGHT1.1 17.2,31.7 21.2,35.7 24.7,35.7 26.7,37.7 D8.1
  Top Layer w0.2: RIGHT1.3 RIGHT1.1
$4N10774: length 30
  Top Layer w0.15: TOP1.3 4.2,40.9 4.7,40.4 ; v1(8.3,40.4) 4.7,40.4 ; 4.7,40.4 4.2,39.9 TOP1.1 ; v1(26.8,39.4) D7.1
  Bottom Layer w0.15: v1(8.3,40.4) 25.8,40.4 v1(26.8,39.4)
$4N10782: length 22.2
  Top Layer w0.15: v1(25.8,42.6) 25.8,41.7 26.4,41.1 D6.1 ; LEFT1.3 v1(18.5,50.2)
  Top Layer w0.2: LEFT1.3 LEFT1.1
  Bottom Layer w0.15: v1(25.8,42.6) 25.8,44.7 20.3,50.2 v1(18.5,50.2)
$4N10794: length 9.8
  Top Layer w0.15: D5.1 27,42.8 26.6,43.2 BOTTOM1.1 BOTTOM1.3
$4N10842: length 38.6
  Top Layer w0.15: 45.23,49.63 v1(46,50.4) ; v1(55.7,46.2) 62.5,46.2 64.8,43.9 v1(64.8,40.9)
  Bottom Layer w0.15: 66.5,28.6 66.4,28.7 66.4,29 65.8,29.6 65.8,36.2 64.8,37.2 v1(64.8,40.9) ; v1(46,50.4) 51.5,50.4 v1(55.7,46.2)
$4N10903: length 20
  Top Layer w0.15: B1.3 B1.1 v1(55.7,49.2) ; 44.03,50.83 v1(44.8,51.6)
  Bottom Layer w0.15: v1(44.8,51.6) 53.3,51.6 v1(55.7,49.2)
$4N10915: length 16
  Top Layer w0.15: 47.5,37.7 47,37.2 A1.1 ; 47.5,37.7 48,37.2 A1.3 ; 47.5,37.7 47.53,37.73 47.53,47.13 47.63,47.23
$4N17155: length 27.7
  Top Layer w0.15: v1(55.4,45.4) 62.4,45.4 64.1,43.7 64.1,40.4 v1(65.5,39) ; 46.43,48.43 v1(47.2,49.2)
  Bottom Layer w0.15: VOL_UP.1 66.8,37.7 v1(65.5,39) ; v1(47.2,49.2) 51.6,49.2 v1(55.4,45.4)
